# EAGLE schematic MasterPCB_transfer (EAGLE 9.6.2), part 2 of 3
## Sheet 11 of 12: Connectors and fusing
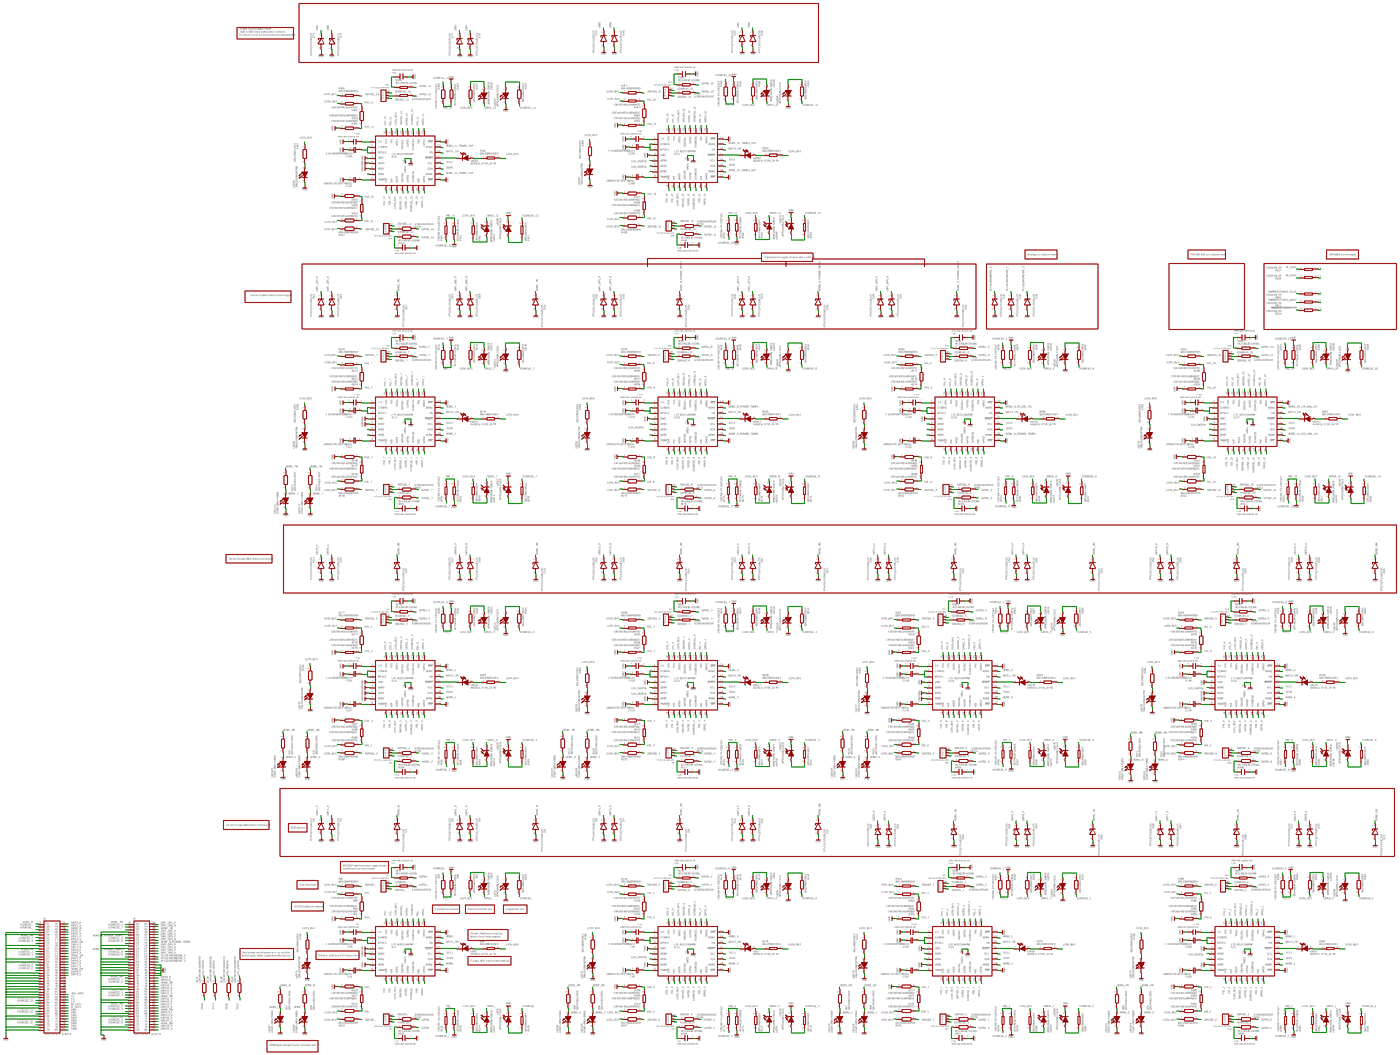
[diagram p13: schematic, sheet 11, overview]
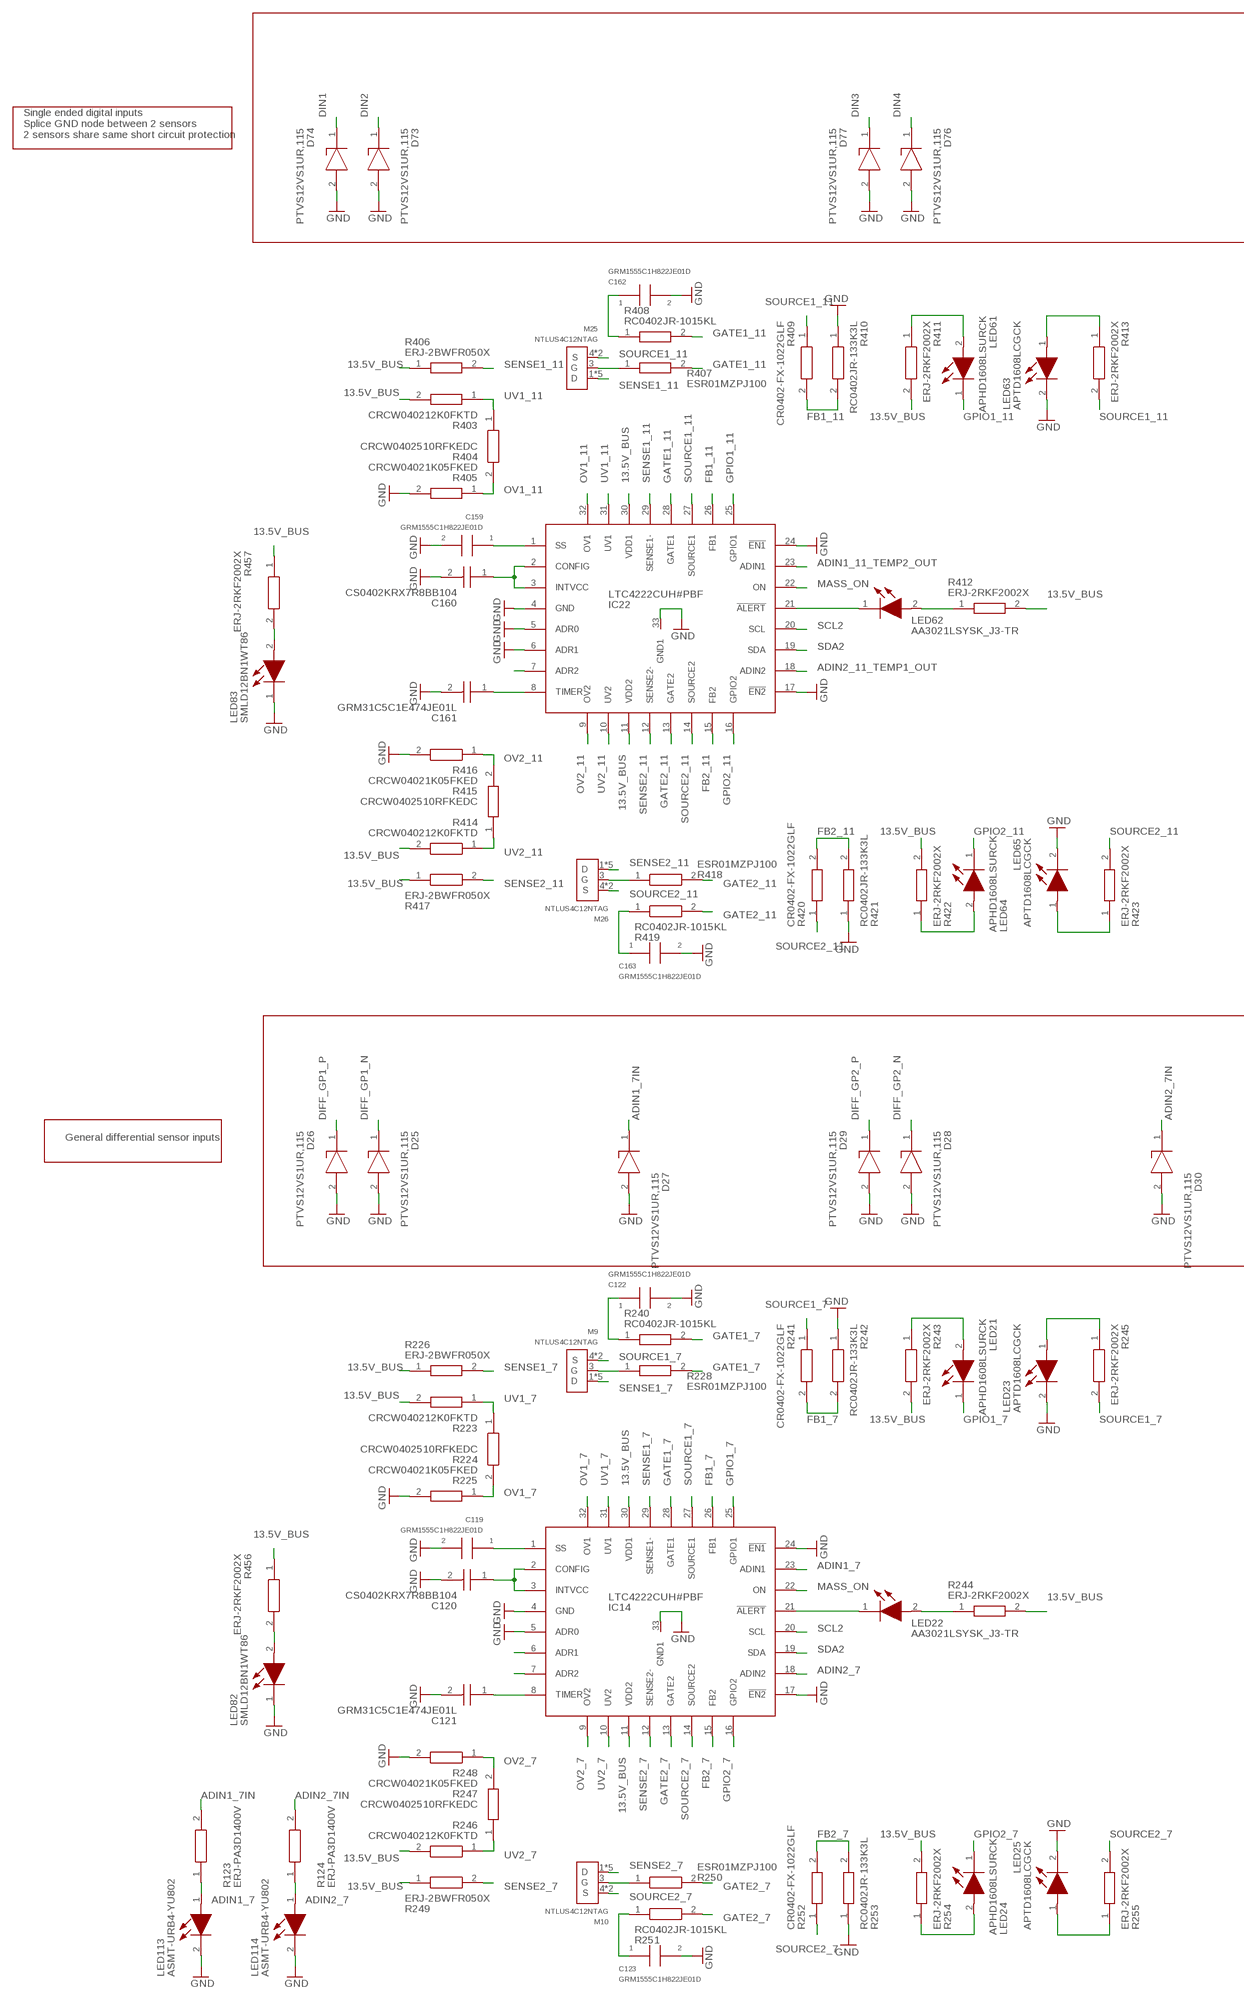
[diagram p14: schematic, sheet 11, part 1 of 6]
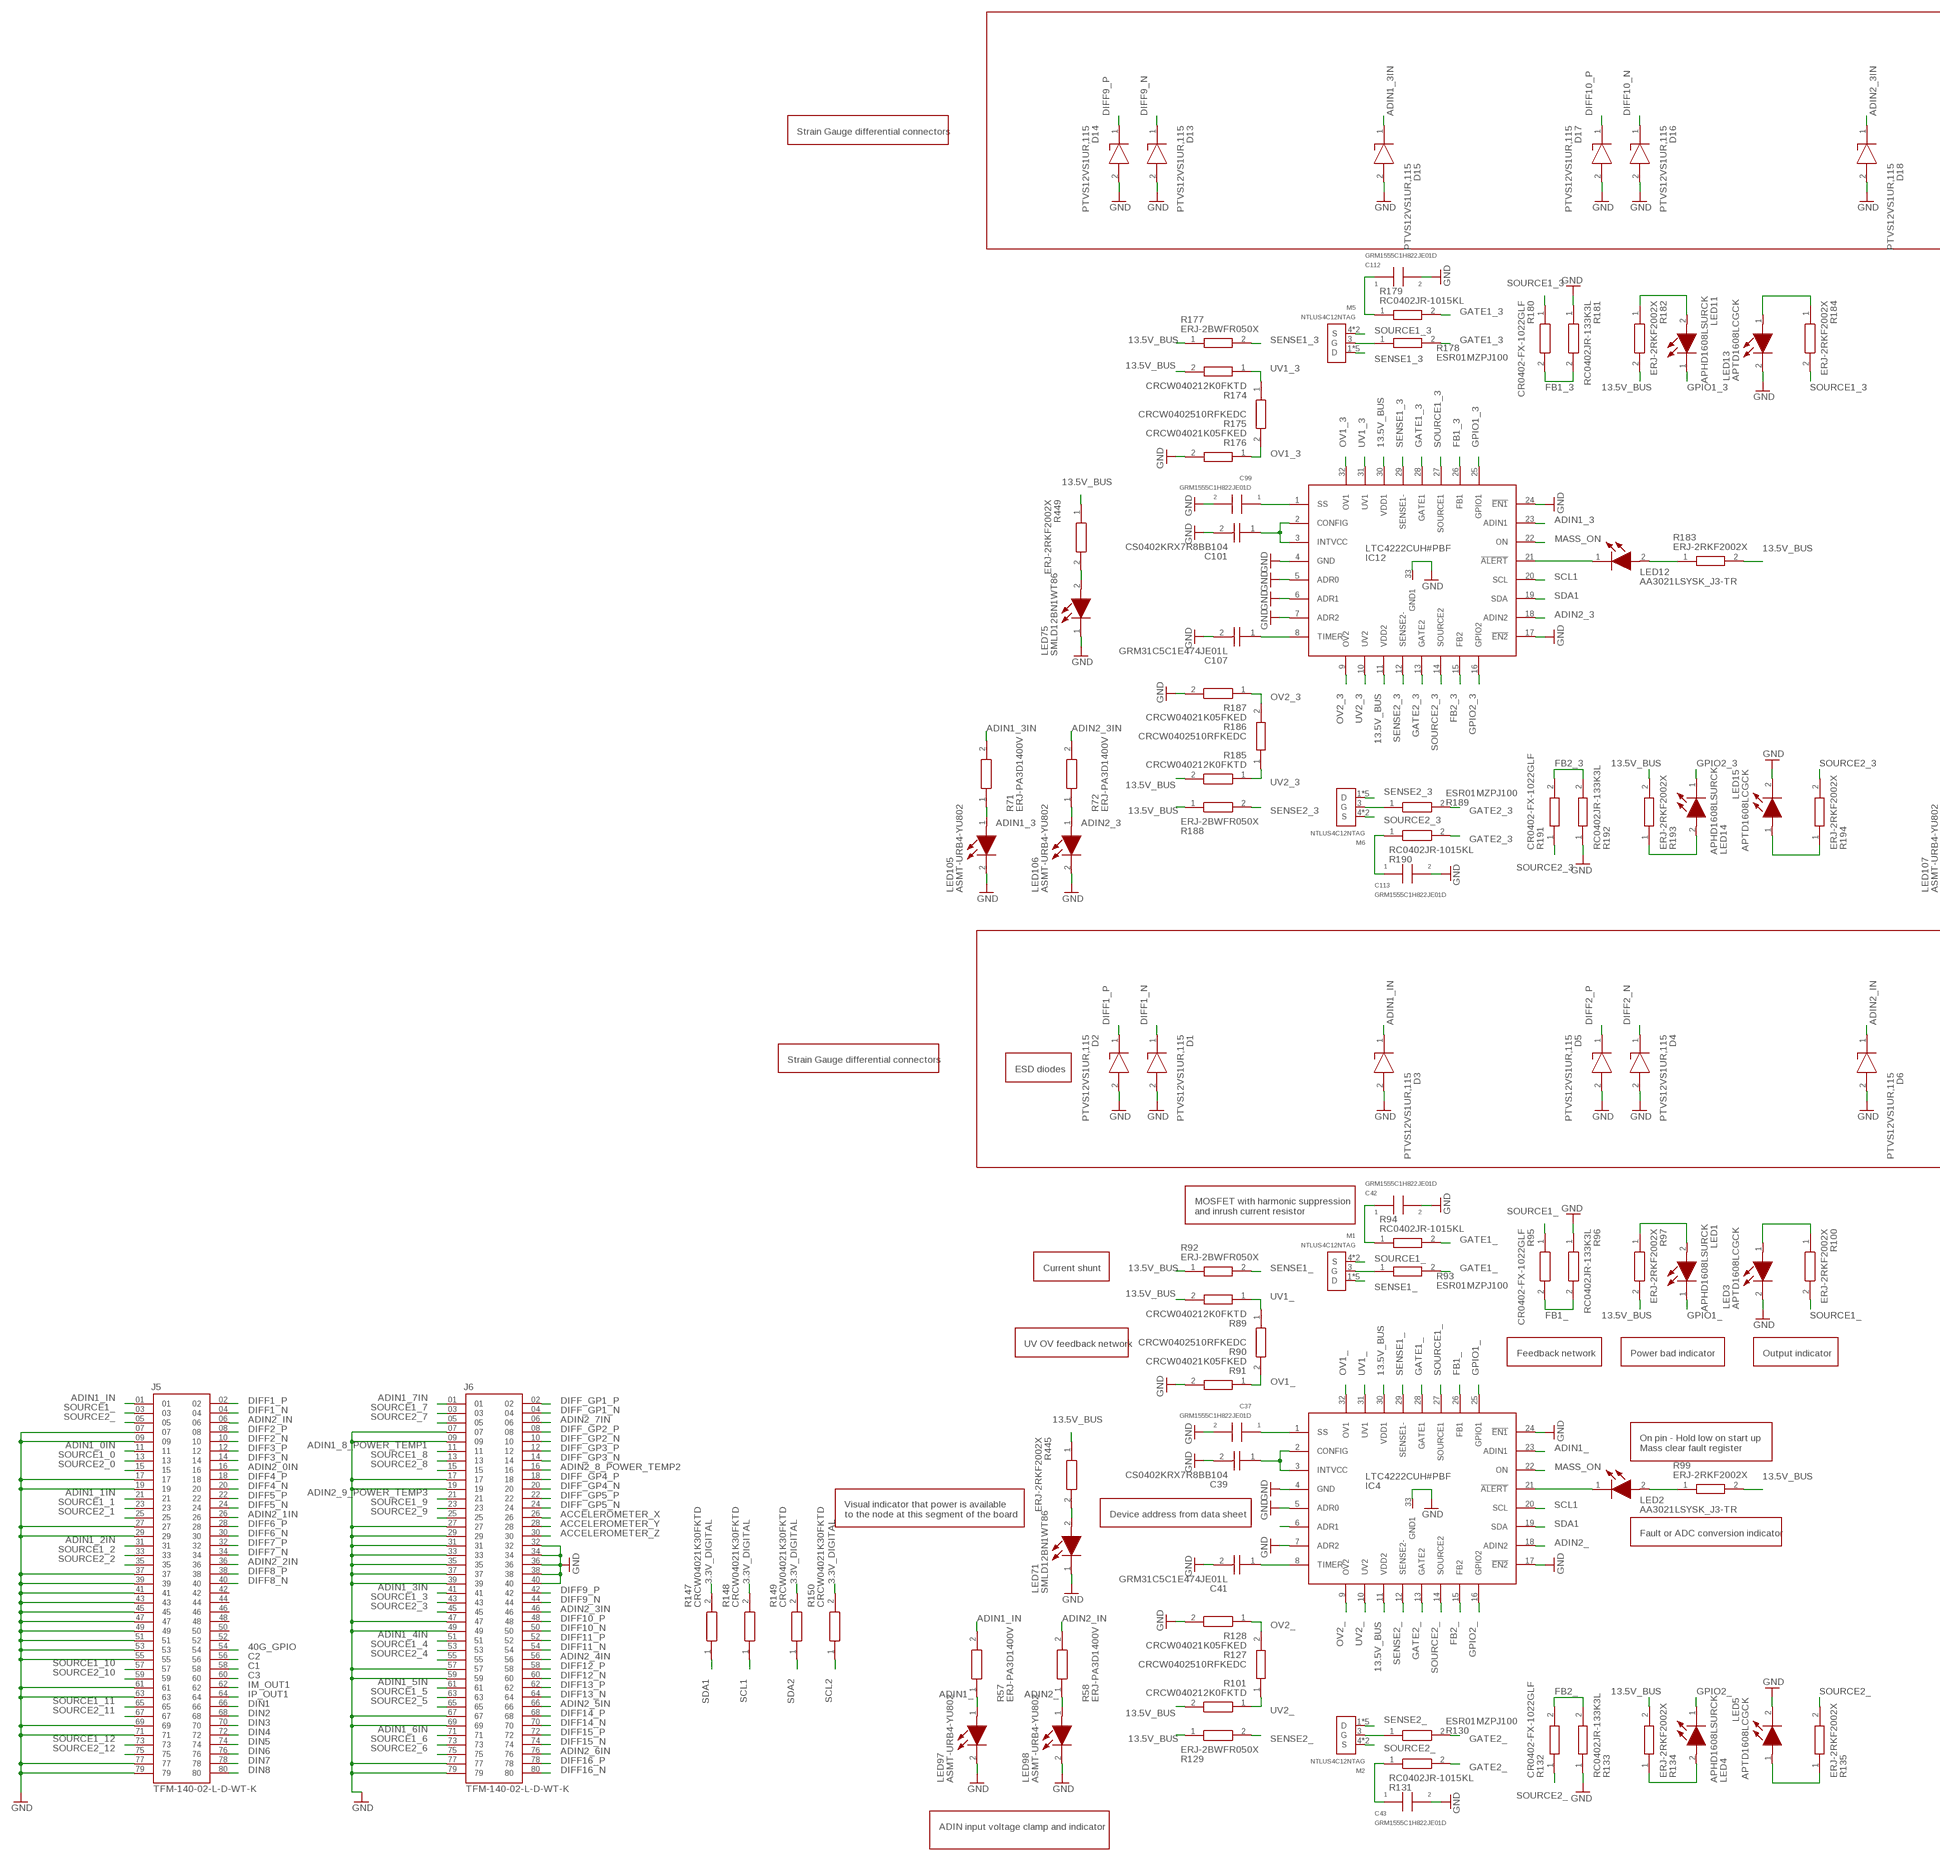
[diagram p15: schematic, sheet 11, part 2 of 6]
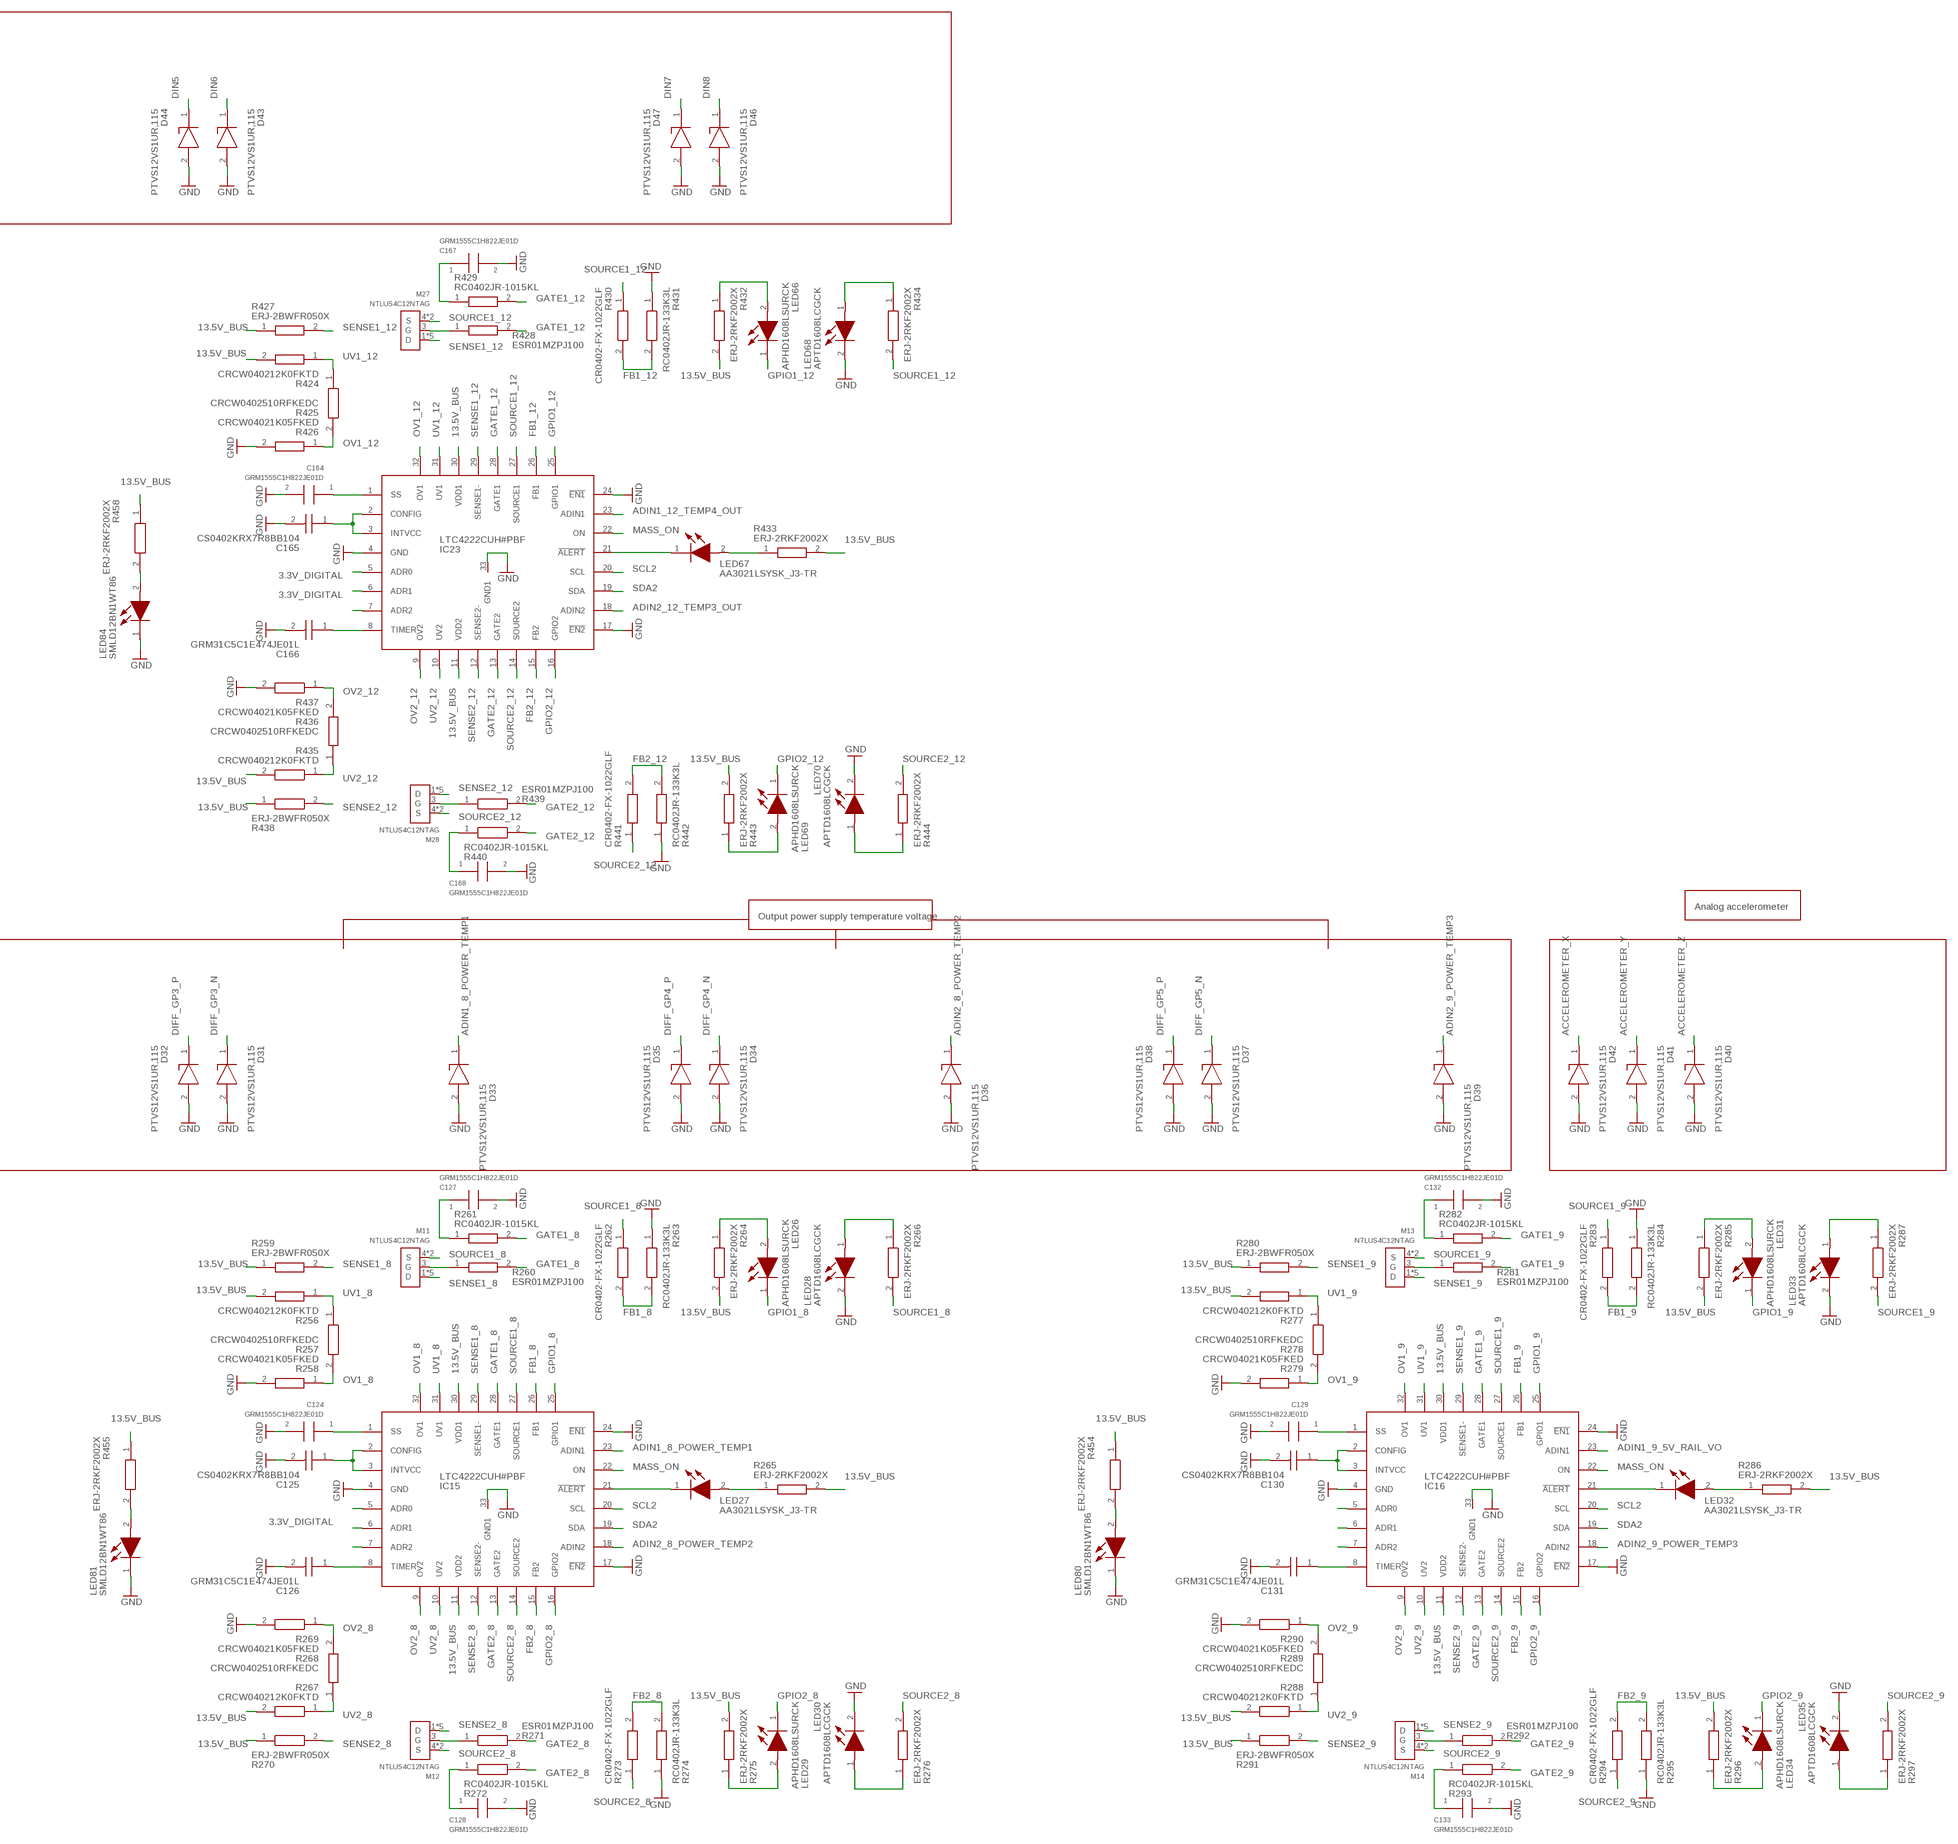
[diagram p16: schematic, sheet 11, part 3 of 6]
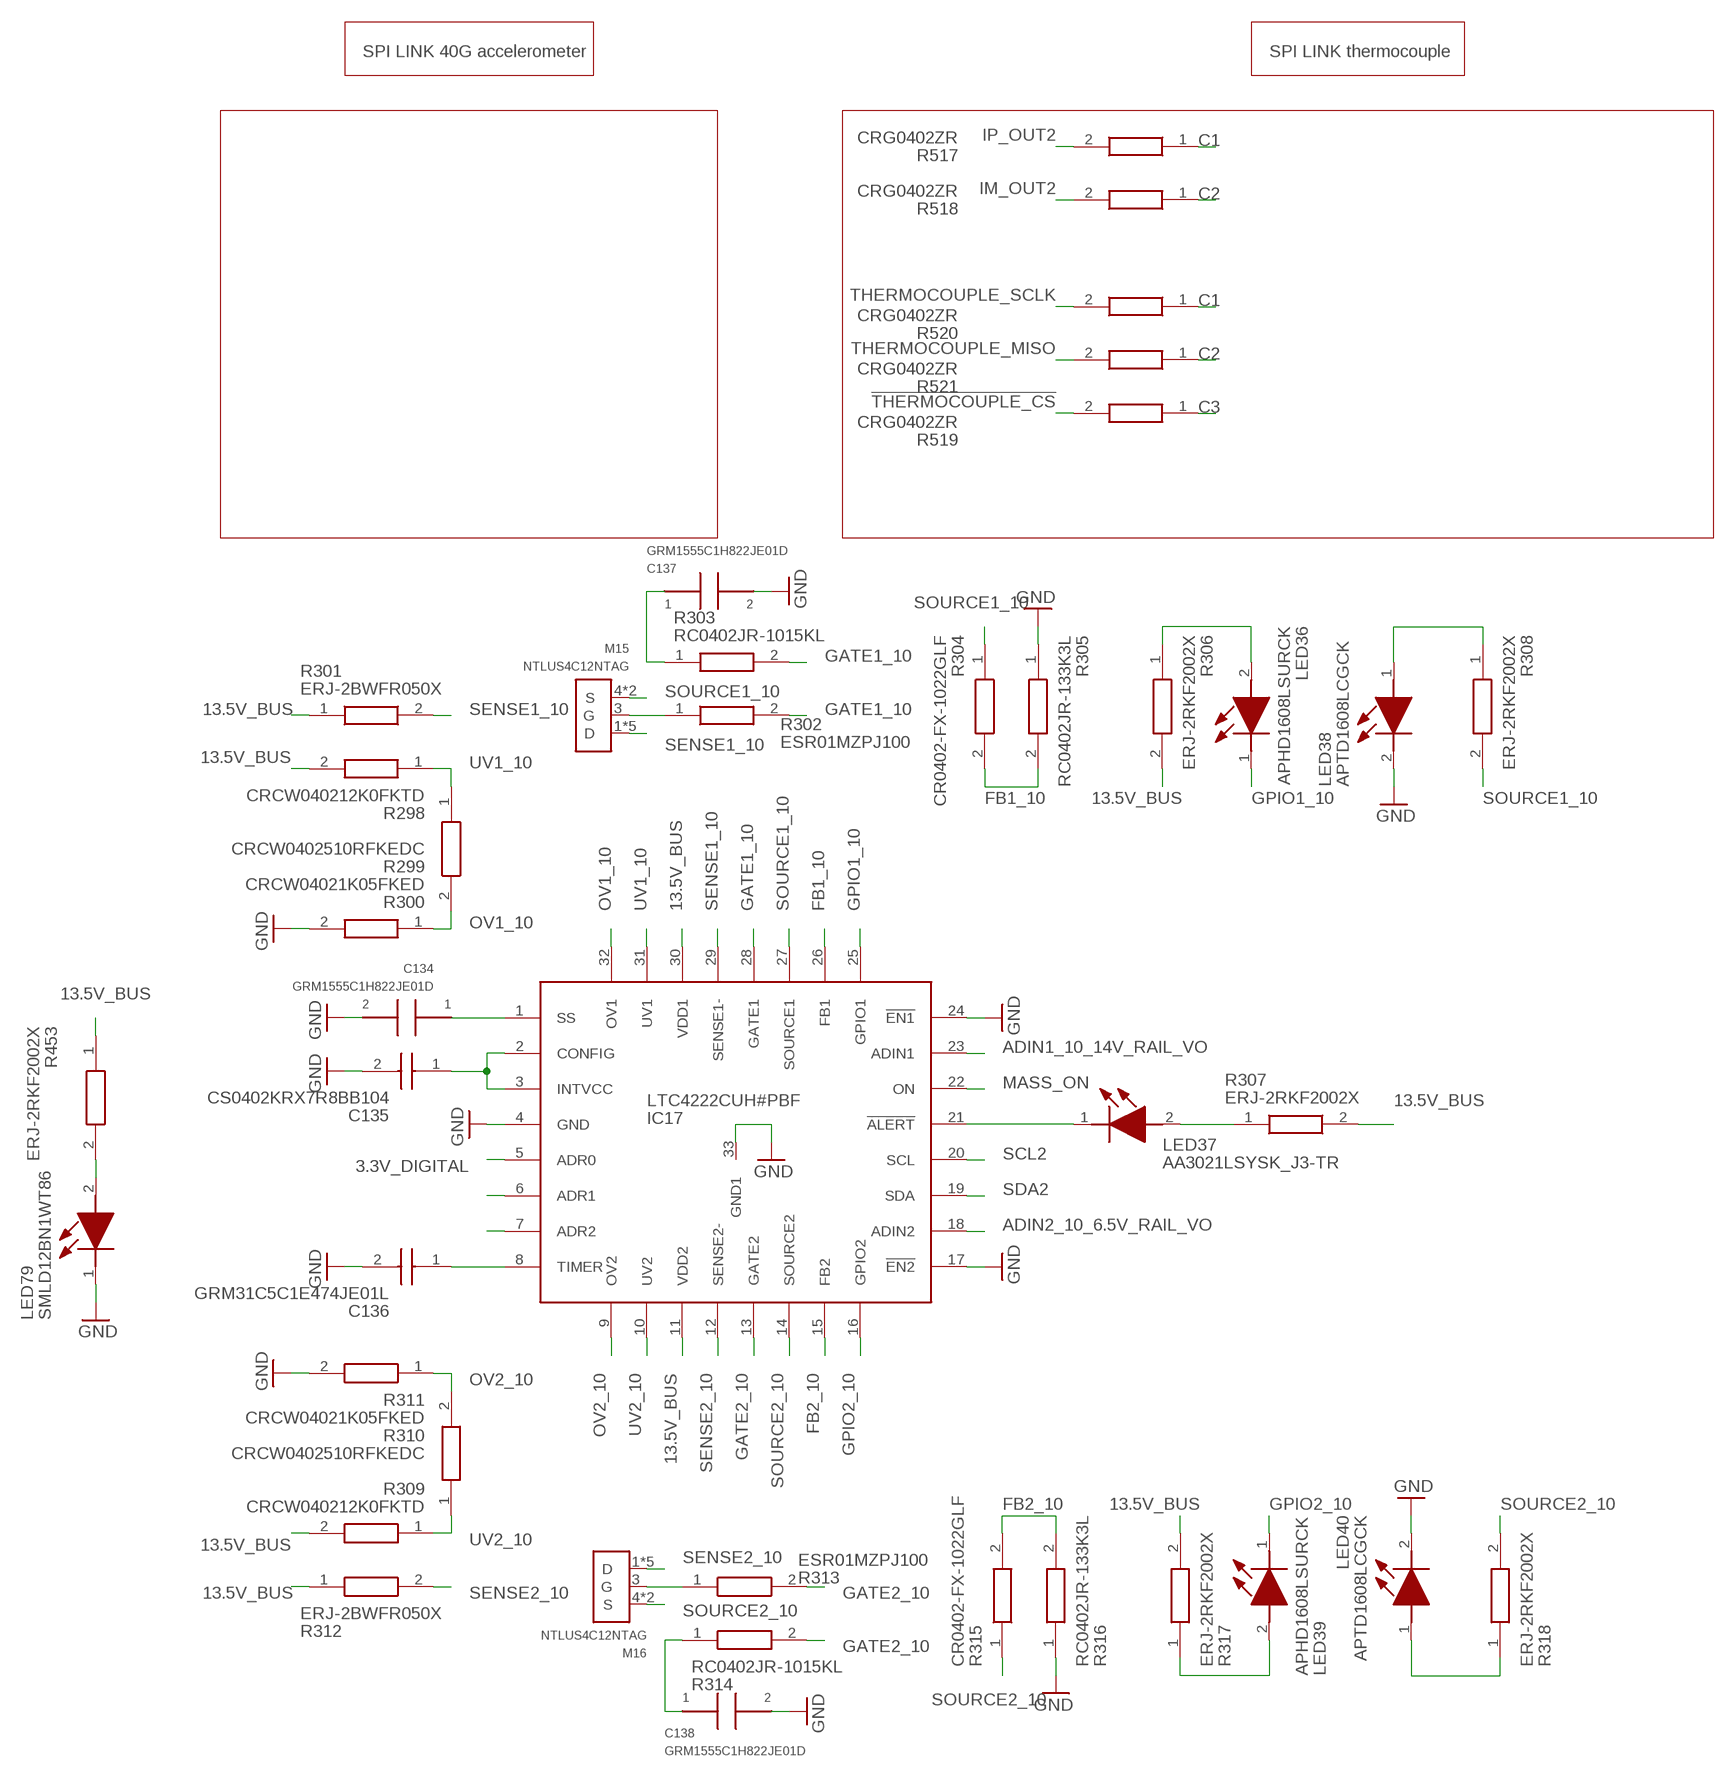
[diagram p17: schematic, sheet 11, part 4 of 6]
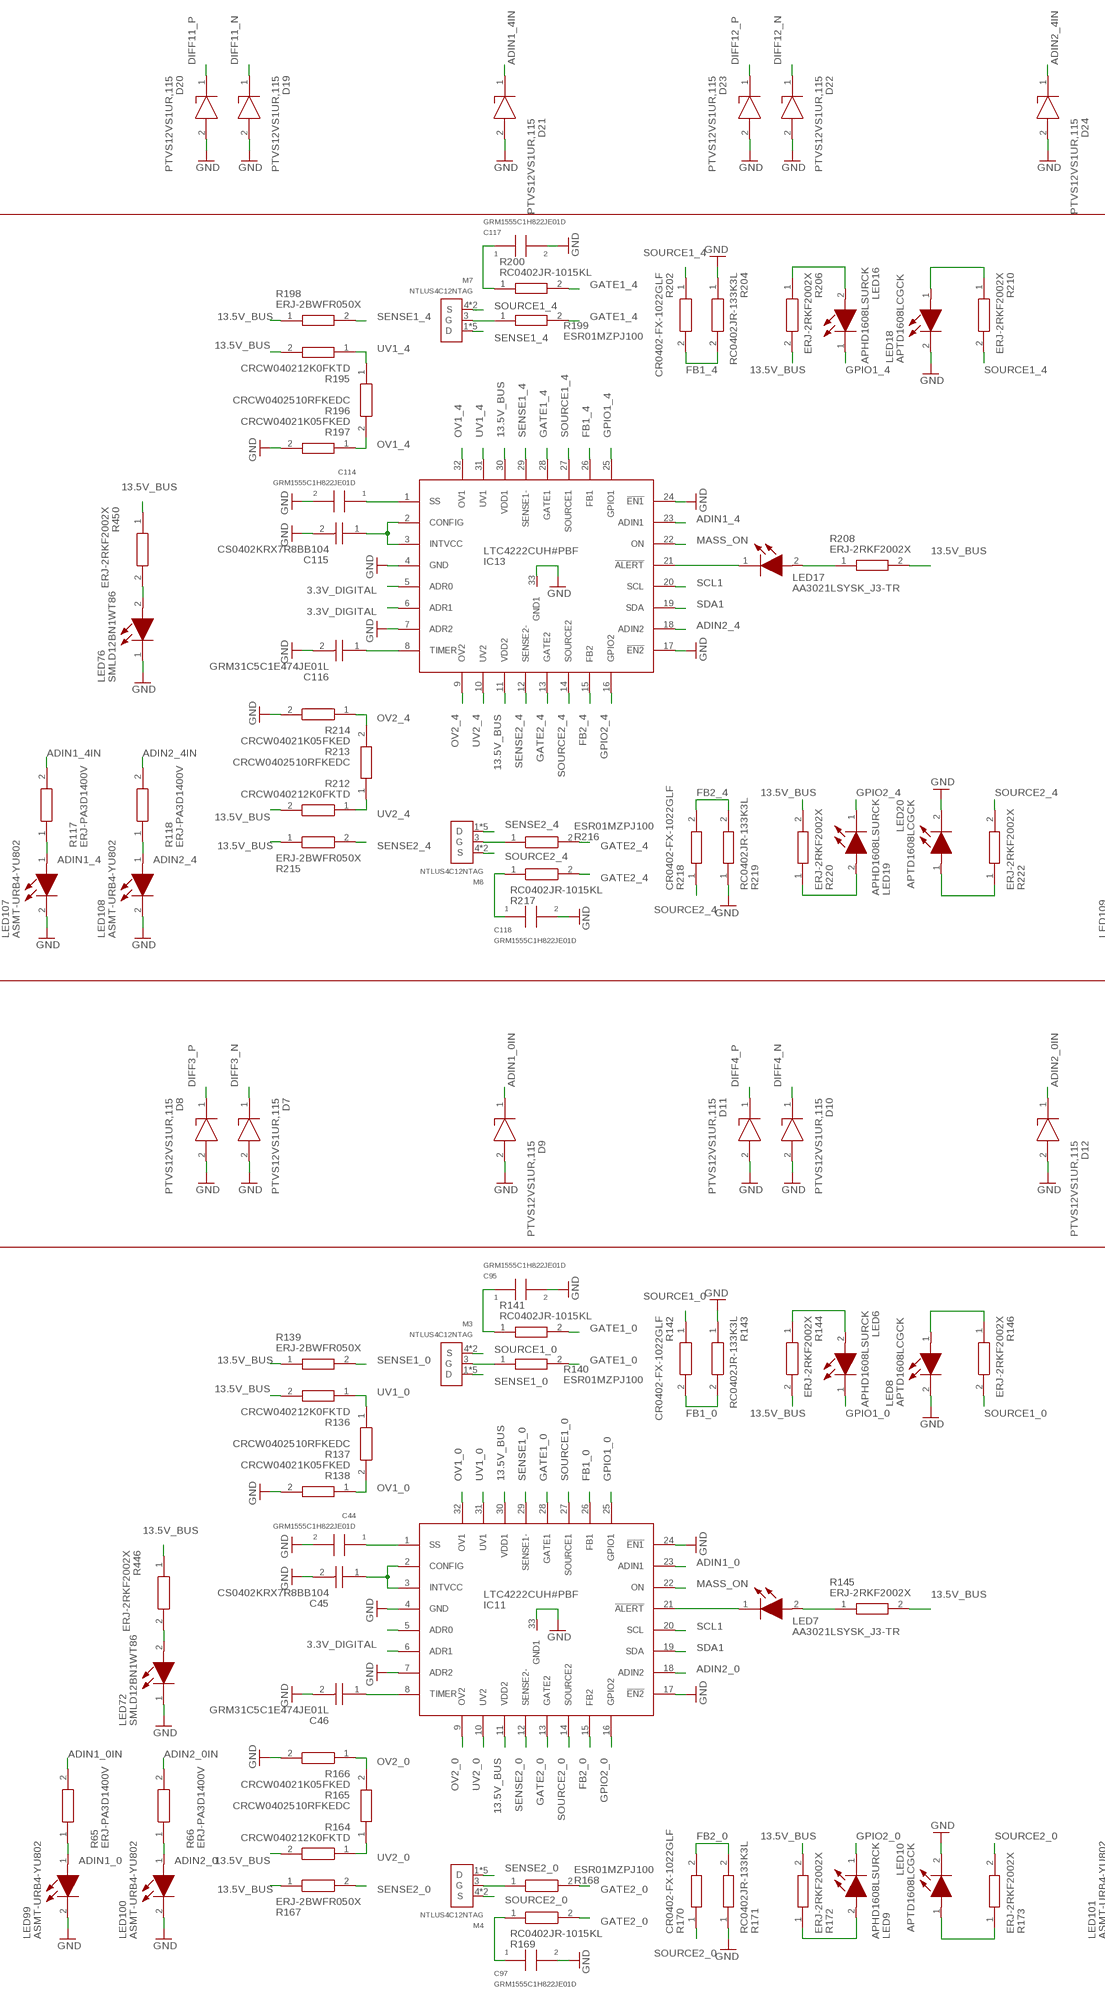
[diagram p18: schematic, sheet 11, part 5 of 6]
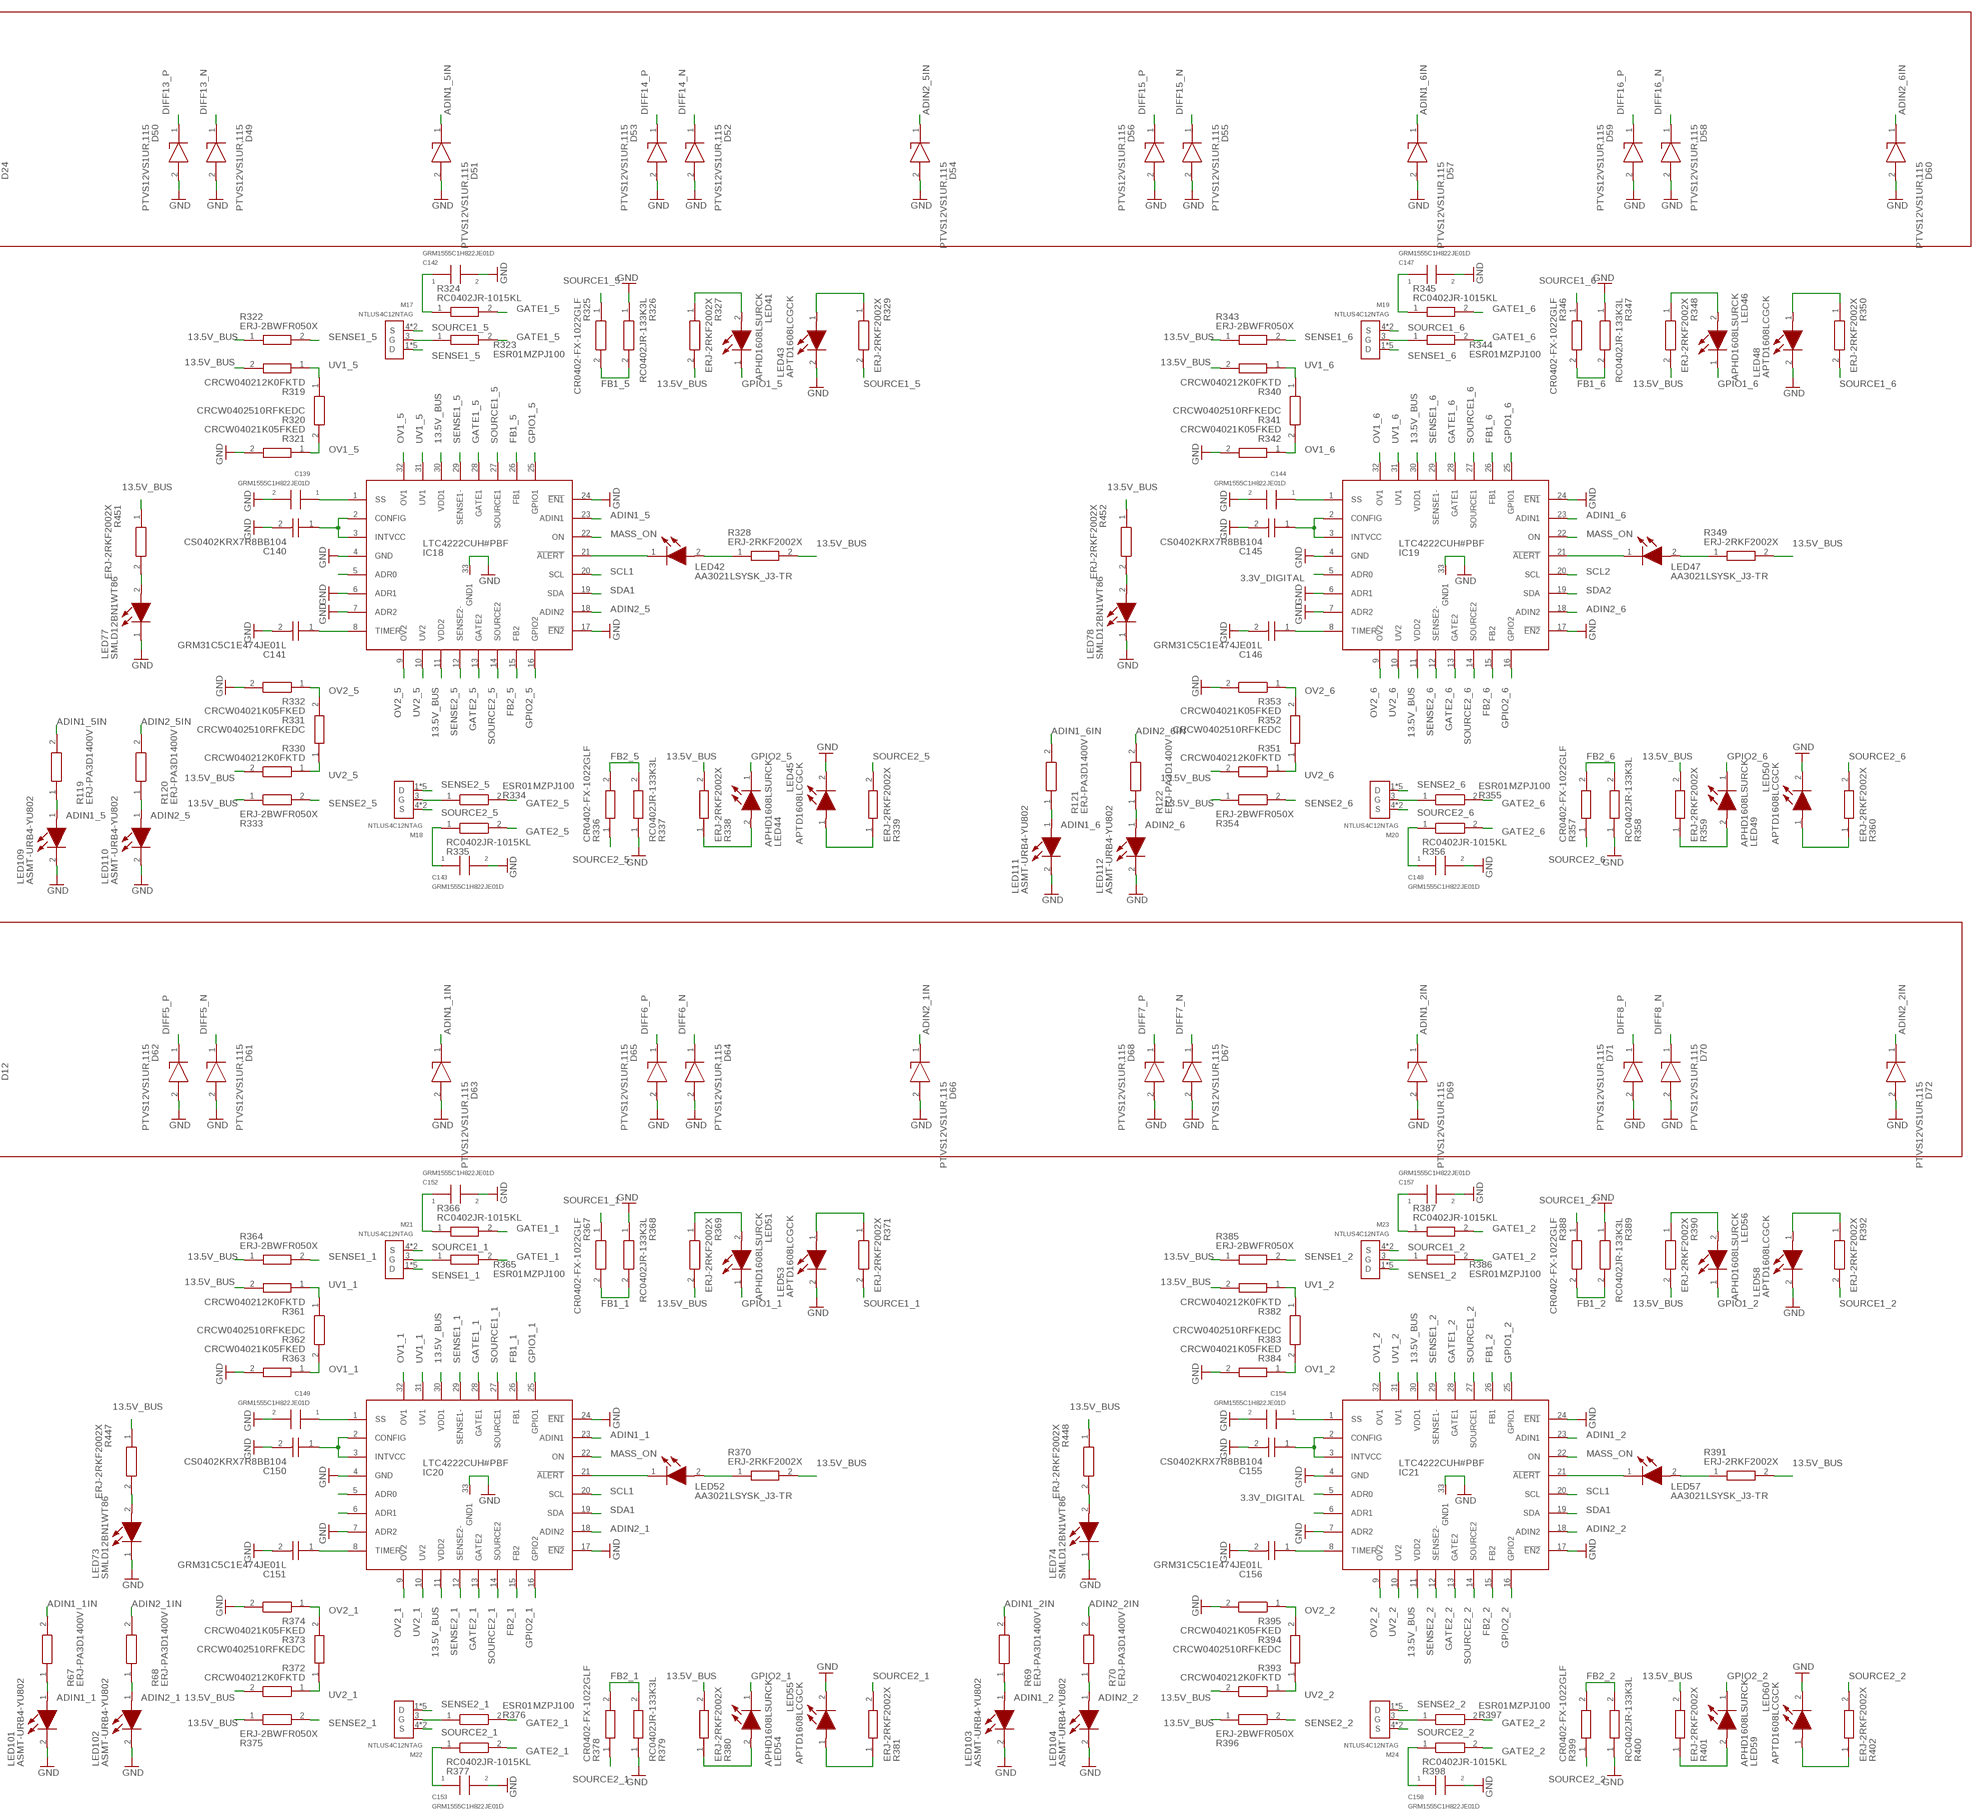
[diagram p19: schematic, sheet 11, part 6 of 6]

### Parts
C37  GRM1555C1H822JE01D  [0402CAP]
C39  CS0402KRX7R8BB104  [CAPC1005X65N]
C41  GRM31C5C1E474JE01L  [CAPC3216X180N]
C42  GRM1555C1H822JE01D  [0402CAP]
C43  GRM1555C1H822JE01D  [0402CAP]
C44  GRM1555C1H822JE01D  [0402CAP]
C45  CS0402KRX7R8BB104  [CAPC1005X65N]
C46  GRM31C5C1E474JE01L  [CAPC3216X180N]
C95  GRM1555C1H822JE01D  [0402CAP]
C97  GRM1555C1H822JE01D  [0402CAP]
C99  GRM1555C1H822JE01D  [0402CAP]
C101  CS0402KRX7R8BB104  [CAPC1005X65N]
C107  GRM31C5C1E474JE01L  [CAPC3216X180N]
C112  GRM1555C1H822JE01D  [0402CAP]
C113  GRM1555C1H822JE01D  [0402CAP]
C114  GRM1555C1H822JE01D  [0402CAP]
C115  CS0402KRX7R8BB104  [CAPC1005X65N]
C116  GRM31C5C1E474JE01L  [CAPC3216X180N]
C117  GRM1555C1H822JE01D  [0402CAP]
C118  GRM1555C1H822JE01D  [0402CAP]
C119  GRM1555C1H822JE01D  [0402CAP]
C120  CS0402KRX7R8BB104  [CAPC1005X65N]
C121  GRM31C5C1E474JE01L  [CAPC3216X180N]
C122  GRM1555C1H822JE01D  [0402CAP]
C123  GRM1555C1H822JE01D  [0402CAP]
C124  GRM1555C1H822JE01D  [0402CAP]
C125  CS0402KRX7R8BB104  [CAPC1005X65N]
C126  GRM31C5C1E474JE01L  [CAPC3216X180N]
C127  GRM1555C1H822JE01D  [0402CAP]
C128  GRM1555C1H822JE01D  [0402CAP]
C129  GRM1555C1H822JE01D  [0402CAP]
C130  CS0402KRX7R8BB104  [CAPC1005X65N]
C131  GRM31C5C1E474JE01L  [CAPC3216X180N]
C132  GRM1555C1H822JE01D  [0402CAP]
C133  GRM1555C1H822JE01D  [0402CAP]
C134  GRM1555C1H822JE01D  [0402CAP]
C135  CS0402KRX7R8BB104  [CAPC1005X65N]
C136  GRM31C5C1E474JE01L  [CAPC3216X180N]
C137  GRM1555C1H822JE01D  [0402CAP]
C138  GRM1555C1H822JE01D  [0402CAP]
C139  GRM1555C1H822JE01D  [0402CAP]
C140  CS0402KRX7R8BB104  [CAPC1005X65N]
C141  GRM31C5C1E474JE01L  [CAPC3216X180N]
C142  GRM1555C1H822JE01D  [0402CAP]
C143  GRM1555C1H822JE01D  [0402CAP]
C144  GRM1555C1H822JE01D  [0402CAP]
C145  CS0402KRX7R8BB104  [CAPC1005X65N]
C146  GRM31C5C1E474JE01L  [CAPC3216X180N]
C147  GRM1555C1H822JE01D  [0402CAP]
C148  GRM1555C1H822JE01D  [0402CAP]
C149  GRM1555C1H822JE01D  [0402CAP]
C150  CS0402KRX7R8BB104  [CAPC1005X65N]
C151  GRM31C5C1E474JE01L  [CAPC3216X180N]
C152  GRM1555C1H822JE01D  [0402CAP]
C153  GRM1555C1H822JE01D  [0402CAP]
C154  GRM1555C1H822JE01D  [0402CAP]
C155  CS0402KRX7R8BB104  [CAPC1005X65N]
C156  GRM31C5C1E474JE01L  [CAPC3216X180N]
C157  GRM1555C1H822JE01D  [0402CAP]
C158  GRM1555C1H822JE01D  [0402CAP]
C159  GRM1555C1H822JE01D  [0402CAP]
C160  CS0402KRX7R8BB104  [CAPC1005X65N]
C161  GRM31C5C1E474JE01L  [CAPC3216X180N]
C162  GRM1555C1H822JE01D  [0402CAP]
C163  GRM1555C1H822JE01D  [0402CAP]
C164  GRM1555C1H822JE01D  [0402CAP]
C165  CS0402KRX7R8BB104  [CAPC1005X65N]
C166  GRM31C5C1E474JE01L  [CAPC3216X180N]
C167  GRM1555C1H822JE01D  [0402CAP]
C168  GRM1555C1H822JE01D  [0402CAP]
D1  PTVS12VS1UR,115  [SOD123W]
D2  PTVS12VS1UR,115  [SOD123W]
D3  PTVS12VS1UR,115  [SOD123W]
D4  PTVS12VS1UR,115  [SOD123W]
D5  PTVS12VS1UR,115  [SOD123W]
D6  PTVS12VS1UR,115  [SOD123W]
D7  PTVS12VS1UR,115  [SOD123W]
D8  PTVS12VS1UR,115  [SOD123W]
D9  PTVS12VS1UR,115  [SOD123W]
D10  PTVS12VS1UR,115  [SOD123W]
D11  PTVS12VS1UR,115  [SOD123W]
D12  PTVS12VS1UR,115  [SOD123W]
D13  PTVS12VS1UR,115  [SOD123W]
D14  PTVS12VS1UR,115  [SOD123W]
D15  PTVS12VS1UR,115  [SOD123W]
D16  PTVS12VS1UR,115  [SOD123W]
D17  PTVS12VS1UR,115  [SOD123W]
D18  PTVS12VS1UR,115  [SOD123W]
D19  PTVS12VS1UR,115  [SOD123W]
D20  PTVS12VS1UR,115  [SOD123W]
D21  PTVS12VS1UR,115  [SOD123W]
D22  PTVS12VS1UR,115  [SOD123W]
D23  PTVS12VS1UR,115  [SOD123W]
D24  PTVS12VS1UR,115  [SOD123W]
D25  PTVS12VS1UR,115  [SOD123W]
D26  PTVS12VS1UR,115  [SOD123W]
D27  PTVS12VS1UR,115  [SOD123W]
D28  PTVS12VS1UR,115  [SOD123W]
D29  PTVS12VS1UR,115  [SOD123W]
D30  PTVS12VS1UR,115  [SOD123W]
D31  PTVS12VS1UR,115  [SOD123W]
D32  PTVS12VS1UR,115  [SOD123W]
D33  PTVS12VS1UR,115  [SOD123W]
D34  PTVS12VS1UR,115  [SOD123W]
D35  PTVS12VS1UR,115  [SOD123W]
D36  PTVS12VS1UR,115  [SOD123W]
D37  PTVS12VS1UR,115  [SOD123W]
D38  PTVS12VS1UR,115  [SOD123W]
D39  PTVS12VS1UR,115  [SOD123W]
D40  PTVS12VS1UR,115  [SOD123W]
D41  PTVS12VS1UR,115  [SOD123W]
D42  PTVS12VS1UR,115  [SOD123W]
D43  PTVS12VS1UR,115  [SOD123W]
D44  PTVS12VS1UR,115  [SOD123W]
D46  PTVS12VS1UR,115  [SOD123W]
D47  PTVS12VS1UR,115  [SOD123W]
D49  PTVS12VS1UR,115  [SOD123W]
D50  PTVS12VS1UR,115  [SOD123W]
D51  PTVS12VS1UR,115  [SOD123W]
D52  PTVS12VS1UR,115  [SOD123W]
D53  PTVS12VS1UR,115  [SOD123W]
D54  PTVS12VS1UR,115  [SOD123W]
D55  PTVS12VS1UR,115  [SOD123W]
D56  PTVS12VS1UR,115  [SOD123W]
D57  PTVS12VS1UR,115  [SOD123W]
D58  PTVS12VS1UR,115  [SOD123W]
D59  PTVS12VS1UR,115  [SOD123W]
D60  PTVS12VS1UR,115  [SOD123W]
D61  PTVS12VS1UR,115  [SOD123W]
D62  PTVS12VS1UR,115  [SOD123W]
D63  PTVS12VS1UR,115  [SOD123W]
D64  PTVS12VS1UR,115  [SOD123W]
D65  PTVS12VS1UR,115  [SOD123W]
D66  PTVS12VS1UR,115  [SOD123W]
D67  PTVS12VS1UR,115  [SOD123W]
D68  PTVS12VS1UR,115  [SOD123W]
D69  PTVS12VS1UR,115  [SOD123W]
D70  PTVS12VS1UR,115  [SOD123W]
D71  PTVS12VS1UR,115  [SOD123W]
D72  PTVS12VS1UR,115  [SOD123W]
D73  PTVS12VS1UR,115  [SOD123W]
D74  PTVS12VS1UR,115  [SOD123W]
D76  PTVS12VS1UR,115  [SOD123W]
D77  PTVS12VS1UR,115  [SOD123W]
IC4  LTC4222CUH#PBF  [QFN50P500X500X80-33T345N]
IC11  LTC4222CUH#PBF  [QFN50P500X500X80-33T345N]
IC12  LTC4222CUH#PBF  [QFN50P500X500X80-33T345N]
IC13  LTC4222CUH#PBF  [QFN50P500X500X80-33T345N]
IC14  LTC4222CUH#PBF  [QFN50P500X500X80-33T345N]
IC15  LTC4222CUH#PBF  [QFN50P500X500X80-33T345N]
IC16  LTC4222CUH#PBF  [QFN50P500X500X80-33T345N]
IC17  LTC4222CUH#PBF  [QFN50P500X500X80-33T345N]
IC18  LTC4222CUH#PBF  [QFN50P500X500X80-33T345N]
IC19  LTC4222CUH#PBF  [QFN50P500X500X80-33T345N]
IC20  LTC4222CUH#PBF  [QFN50P500X500X80-33T345N]
IC21  LTC4222CUH#PBF  [QFN50P500X500X80-33T345N]
IC22  LTC4222CUH#PBF  [QFN50P500X500X80-33T345N]
IC23  LTC4222CUH#PBF  [QFN50P500X500X80-33T345N]
J5  TFM-140-02-L-D-WT-K  [SAMTEC_TFM-140-02-L-D-WT-K]
J6  TFM-140-02-L-D-WT-K  [SAMTEC_TFM-140-02-L-D-WT-K]
LED1  APHD1608LSURCK  [LEDM168X80N]
LED2  AA3021LSYSK_J3-TR  [AA3021LSYSKJ3TR]
LED3  APTD1608LCGCK  [APT1608CGCK]
LED4  APHD1608LSURCK  [LEDM168X80N]
LED5  APTD1608LCGCK  [APT1608CGCK]
LED6  APHD1608LSURCK  [LEDM168X80N]
LED7  AA3021LSYSK_J3-TR  [AA3021LSYSKJ3TR]
LED8  APTD1608LCGCK  [APT1608CGCK]
LED9  APHD1608LSURCK  [LEDM168X80N]
LED10  APTD1608LCGCK  [APT1608CGCK]
LED11  APHD1608LSURCK  [LEDM168X80N]
LED12  AA3021LSYSK_J3-TR  [AA3021LSYSKJ3TR]
LED13  APTD1608LCGCK  [APT1608CGCK]
LED14  APHD1608LSURCK  [LEDM168X80N]
LED15  APTD1608LCGCK  [APT1608CGCK]
LED16  APHD1608LSURCK  [LEDM168X80N]
LED17  AA3021LSYSK_J3-TR  [AA3021LSYSKJ3TR]
LED18  APTD1608LCGCK  [APT1608CGCK]
LED19  APHD1608LSURCK  [LEDM168X80N]
LED20  APTD1608LCGCK  [APT1608CGCK]
LED21  APHD1608LSURCK  [LEDM168X80N]
LED22  AA3021LSYSK_J3-TR  [AA3021LSYSKJ3TR]
LED23  APTD1608LCGCK  [APT1608CGCK]
LED24  APHD1608LSURCK  [LEDM168X80N]
LED25  APTD1608LCGCK  [APT1608CGCK]
LED26  APHD1608LSURCK  [LEDM168X80N]
LED27  AA3021LSYSK_J3-TR  [AA3021LSYSKJ3TR]
LED28  APTD1608LCGCK  [APT1608CGCK]
LED29  APHD1608LSURCK  [LEDM168X80N]
LED30  APTD1608LCGCK  [APT1608CGCK]
LED31  APHD1608LSURCK  [LEDM168X80N]
LED32  AA3021LSYSK_J3-TR  [AA3021LSYSKJ3TR]
LED33  APTD1608LCGCK  [APT1608CGCK]
LED34  APHD1608LSURCK  [LEDM168X80N]
LED35  APTD1608LCGCK  [APT1608CGCK]
LED36  APHD1608LSURCK  [LEDM168X80N]
LED37  AA3021LSYSK_J3-TR  [AA3021LSYSKJ3TR]
LED38  APTD1608LCGCK  [APT1608CGCK]
LED39  APHD1608LSURCK  [LEDM168X80N]
LED40  APTD1608LCGCK  [APT1608CGCK]
LED41  APHD1608LSURCK  [LEDM168X80N]
LED42  AA3021LSYSK_J3-TR  [AA3021LSYSKJ3TR]
LED43  APTD1608LCGCK  [APT1608CGCK]
LED44  APHD1608LSURCK  [LEDM168X80N]
LED45  APTD1608LCGCK  [APT1608CGCK]
LED46  APHD1608LSURCK  [LEDM168X80N]
LED47  AA3021LSYSK_J3-TR  [AA3021LSYSKJ3TR]
LED48  APTD1608LCGCK  [APT1608CGCK]
LED49  APHD1608LSURCK  [LEDM168X80N]
LED50  APTD1608LCGCK  [APT1608CGCK]
LED51  APHD1608LSURCK  [LEDM168X80N]
LED52  AA3021LSYSK_J3-TR  [AA3021LSYSKJ3TR]
LED53  APTD1608LCGCK  [APT1608CGCK]
LED54  APHD1608LSURCK  [LEDM168X80N]
LED55  APTD1608LCGCK  [APT1608CGCK]
LED56  APHD1608LSURCK  [LEDM168X80N]
LED57  AA3021LSYSK_J3-TR  [AA3021LSYSKJ3TR]
LED58  APTD1608LCGCK  [APT1608CGCK]
LED59  APHD1608LSURCK  [LEDM168X80N]
LED60  APTD1608LCGCK  [APT1608CGCK]
LED61  APHD1608LSURCK  [LEDM168X80N]
LED62  AA3021LSYSK_J3-TR  [AA3021LSYSKJ3TR]
LED63  APTD1608LCGCK  [APT1608CGCK]
LED64  APHD1608LSURCK  [LEDM168X80N]
LED65  APTD1608LCGCK  [APT1608CGCK]
LED66  APHD1608LSURCK  [LEDM168X80N]
LED67  AA3021LSYSK_J3-TR  [AA3021LSYSKJ3TR]
LED68  APTD1608LCGCK  [APT1608CGCK]
LED69  APHD1608LSURCK  [LEDM168X80N]
LED70  APTD1608LCGCK  [APT1608CGCK]
LED71  SMLD12BN1WT86  [LEDM168X65N]
LED72  SMLD12BN1WT86  [LEDM168X65N]
LED73  SMLD12BN1WT86  [LEDM168X65N]
LED74  SMLD12BN1WT86  [LEDM168X65N]
LED75  SMLD12BN1WT86  [LEDM168X65N]
LED76  SMLD12BN1WT86  [LEDM168X65N]
LED77  SMLD12BN1WT86  [LEDM168X65N]
LED78  SMLD12BN1WT86  [LEDM168X65N]
LED79  SMLD12BN1WT86  [LEDM168X65N]
LED80  SMLD12BN1WT86  [LEDM168X65N]
LED81  SMLD12BN1WT86  [LEDM168X65N]
LED82  SMLD12BN1WT86  [LEDM168X65N]
LED83  SMLD12BN1WT86  [LEDM168X65N]
LED84  SMLD12BN1WT86  [LEDM168X65N]
LED97  ASMT-URB4-YU802  [ASMTURB4YU802]
LED98  ASMT-URB4-YU802  [ASMTURB4YU802]
LED99  ASMT-URB4-YU802  [ASMTURB4YU802]
LED100  ASMT-URB4-YU802  [ASMTURB4YU802]
LED101  ASMT-URB4-YU802  [ASMTURB4YU802]
LED102  ASMT-URB4-YU802  [ASMTURB4YU802]
LED103  ASMT-URB4-YU802  [ASMTURB4YU802]
LED104  ASMT-URB4-YU802  [ASMTURB4YU802]
LED105  ASMT-URB4-YU802  [ASMTURB4YU802]
LED106  ASMT-URB4-YU802  [ASMTURB4YU802]
LED107  ASMT-URB4-YU802  [ASMTURB4YU802]
LED108  ASMT-URB4-YU802  [ASMTURB4YU802]
LED109  ASMT-URB4-YU802  [ASMTURB4YU802]
LED110  ASMT-URB4-YU802  [ASMTURB4YU802]
LED111  ASMT-URB4-YU802  [ASMTURB4YU802]
LED112  ASMT-URB4-YU802  [ASMTURB4YU802]
LED113  ASMT-URB4-YU802  [ASMTURB4YU802]
LED114  ASMT-URB4-YU802  [ASMTURB4YU802]
M1  NTLUS4C12NTAG  [TRANS_NTLUS3A18PZTAG]
M2  NTLUS4C12NTAG  [TRANS_NTLUS3A18PZTAG]
M3  NTLUS4C12NTAG  [TRANS_NTLUS3A18PZTAG]
M4  NTLUS4C12NTAG  [TRANS_NTLUS3A18PZTAG]
M5  NTLUS4C12NTAG  [TRANS_NTLUS3A18PZTAG]
M6  NTLUS4C12NTAG  [TRANS_NTLUS3A18PZTAG]
M7  NTLUS4C12NTAG  [TRANS_NTLUS3A18PZTAG]
M8  NTLUS4C12NTAG  [TRANS_NTLUS3A18PZTAG]
M9  NTLUS4C12NTAG  [TRANS_NTLUS3A18PZTAG]
M10  NTLUS4C12NTAG  [TRANS_NTLUS3A18PZTAG]
M11  NTLUS4C12NTAG  [TRANS_NTLUS3A18PZTAG]
M12  NTLUS4C12NTAG  [TRANS_NTLUS3A18PZTAG]
M13  NTLUS4C12NTAG  [TRANS_NTLUS3A18PZTAG]
M14  NTLUS4C12NTAG  [TRANS_NTLUS3A18PZTAG]
M15  NTLUS4C12NTAG  [TRANS_NTLUS3A18PZTAG]
M16  NTLUS4C12NTAG  [TRANS_NTLUS3A18PZTAG]
M17  NTLUS4C12NTAG  [TRANS_NTLUS3A18PZTAG]
M18  NTLUS4C12NTAG  [TRANS_NTLUS3A18PZTAG]
M19  NTLUS4C12NTAG  [TRANS_NTLUS3A18PZTAG]
M20  NTLUS4C12NTAG  [TRANS_NTLUS3A18PZTAG]
M21  NTLUS4C12NTAG  [TRANS_NTLUS3A18PZTAG]
M22  NTLUS4C12NTAG  [TRANS_NTLUS3A18PZTAG]
M23  NTLUS4C12NTAG  [TRANS_NTLUS3A18PZTAG]
M24  NTLUS4C12NTAG  [TRANS_NTLUS3A18PZTAG]
M25  NTLUS4C12NTAG  [TRANS_NTLUS3A18PZTAG]
M26  NTLUS4C12NTAG  [TRANS_NTLUS3A18PZTAG]
M27  NTLUS4C12NTAG  [TRANS_NTLUS3A18PZTAG]
M28  NTLUS4C12NTAG  [TRANS_NTLUS3A18PZTAG]
R57  ERJ-PA3D1400V  [ERJP03_PA3_(0603)]
R58  ERJ-PA3D1400V  [ERJP03_PA3_(0603)]
R65  ERJ-PA3D1400V  [ERJP03_PA3_(0603)]
R66  ERJ-PA3D1400V  [ERJP03_PA3_(0603)]
R67  ERJ-PA3D1400V  [ERJP03_PA3_(0603)]
R68  ERJ-PA3D1400V  [ERJP03_PA3_(0603)]
R69  ERJ-PA3D1400V  [ERJP03_PA3_(0603)]
R70  ERJ-PA3D1400V  [ERJP03_PA3_(0603)]
R71  ERJ-PA3D1400V  [ERJP03_PA3_(0603)]
R72  ERJ-PA3D1400V  [ERJP03_PA3_(0603)]
R89  CRCW040212K0FKTD  [RESC1005X40N]
R90  CRCW0402510RFKEDC  [RESC1005X35N]
R91  CRCW04021K05FKED  [RESC1005X40N]
R92  ERJ-2BWFR050X  [ERJ_2LW_2BW_2B_(0402)]
R93  ESR01MZPJ100  [RESC1005X40N]
R94  RC0402JR-1015KL  [RESC1005X40N]
R95  CR0402-FX-1022GLF  [RESC1005X40N]
R96  RC0402JR-133K3L  [RESC1005X40N]
R97  ERJ-2RKF2002X  [ERJ2R_(0402)]
R99  ERJ-2RKF2002X  [ERJ2R_(0402)]
R100  ERJ-2RKF2002X  [ERJ2R_(0402)]
R101  CRCW040212K0FKTD  [RESC1005X40N]
R117  ERJ-PA3D1400V  [ERJP03_PA3_(0603)]
R118  ERJ-PA3D1400V  [ERJP03_PA3_(0603)]
R119  ERJ-PA3D1400V  [ERJP03_PA3_(0603)]
R120  ERJ-PA3D1400V  [ERJP03_PA3_(0603)]
R121  ERJ-PA3D1400V  [ERJP03_PA3_(0603)]
R122  ERJ-PA3D1400V  [ERJP03_PA3_(0603)]
R123  ERJ-PA3D1400V  [ERJP03_PA3_(0603)]
R124  ERJ-PA3D1400V  [ERJP03_PA3_(0603)]
R127  CRCW0402510RFKEDC  [RESC1005X35N]
R128  CRCW04021K05FKED  [RESC1005X40N]
R129  ERJ-2BWFR050X  [ERJ_2LW_2BW_2B_(0402)]
R130  ESR01MZPJ100  [RESC1005X40N]
R131  RC0402JR-1015KL  [RESC1005X40N]
R132  CR0402-FX-1022GLF  [RESC1005X40N]
R133  RC0402JR-133K3L  [RESC1005X40N]
R134  ERJ-2RKF2002X  [ERJ2R_(0402)]
R135  ERJ-2RKF2002X  [ERJ2R_(0402)]
R136  CRCW040212K0FKTD  [RESC1005X40N]
R137  CRCW0402510RFKEDC  [RESC1005X35N]
R138  CRCW04021K05FKED  [RESC1005X40N]
R139  ERJ-2BWFR050X  [ERJ_2LW_2BW_2B_(0402)]
R140  ESR01MZPJ100  [RESC1005X40N]
R141  RC0402JR-1015KL  [RESC1005X40N]
R142  CR0402-FX-1022GLF  [RESC1005X40N]
R143  RC0402JR-133K3L  [RESC1005X40N]
R144  ERJ-2RKF2002X  [ERJ2R_(0402)]
R145  ERJ-2RKF2002X  [ERJ2R_(0402)]
R146  ERJ-2RKF2002X  [ERJ2R_(0402)]
R147  CRCW04021K30FKTD  [RESC1005X40N]
R148  CRCW04021K30FKTD  [RESC1005X40N]
R149  CRCW04021K30FKTD  [RESC1005X40N]
R150  CRCW04021K30FKTD  [RESC1005X40N]
R164  CRCW040212K0FKTD  [RESC1005X40N]
R165  CRCW0402510RFKEDC  [RESC1005X35N]
R166  CRCW04021K05FKED  [RESC1005X40N]
R167  ERJ-2BWFR050X  [ERJ_2LW_2BW_2B_(0402)]
R168  ESR01MZPJ100  [RESC1005X40N]
R169  RC0402JR-1015KL  [RESC1005X40N]
R170  CR0402-FX-1022GLF  [RESC1005X40N]
R171  RC0402JR-133K3L  [RESC1005X40N]
R172  ERJ-2RKF2002X  [ERJ2R_(0402)]
R173  ERJ-2RKF2002X  [ERJ2R_(0402)]
R174  CRCW040212K0FKTD  [RESC1005X40N]
R175  CRCW0402510RFKEDC  [RESC1005X35N]
R176  CRCW04021K05FKED  [RESC1005X40N]
R177  ERJ-2BWFR050X  [ERJ_2LW_2BW_2B_(0402)]
R178  ESR01MZPJ100  [RESC1005X40N]
R179  RC0402JR-1015KL  [RESC1005X40N]
R180  CR0402-FX-1022GLF  [RESC1005X40N]
R181  RC0402JR-133K3L  [RESC1005X40N]
R182  ERJ-2RKF2002X  [ERJ2R_(0402)]
R183  ERJ-2RKF2002X  [ERJ2R_(0402)]
R184  ERJ-2RKF2002X  [ERJ2R_(0402)]
R185  CRCW040212K0FKTD  [RESC1005X40N]
R186  CRCW0402510RFKEDC  [RESC1005X35N]
R187  CRCW04021K05FKED  [RESC1005X40N]
R188  ERJ-2BWFR050X  [ERJ_2LW_2BW_2B_(0402)]
R189  ESR01MZPJ100  [RESC1005X40N]
R190  RC0402JR-1015KL  [RESC1005X40N]
R191  CR0402-FX-1022GLF  [RESC1005X40N]
R192  RC0402JR-133K3L  [RESC1005X40N]
R193  ERJ-2RKF2002X  [ERJ2R_(0402)]
R194  ERJ-2RKF2002X  [ERJ2R_(0402)]
R195  CRCW040212K0FKTD  [RESC1005X40N]
R196  CRCW0402510RFKEDC  [RESC1005X35N]
R197  CRCW04021K05FKED  [RESC1005X40N]
R198  ERJ-2BWFR050X  [ERJ_2LW_2BW_2B_(0402)]
R199  ESR01MZPJ100  [RESC1005X40N]
R200  RC0402JR-1015KL  [RESC1005X40N]
R202  CR0402-FX-1022GLF  [RESC1005X40N]
R204  RC0402JR-133K3L  [RESC1005X40N]
R206  ERJ-2RKF2002X  [ERJ2R_(0402)]
R208  ERJ-2RKF2002X  [ERJ2R_(0402)]
R210  ERJ-2RKF2002X  [ERJ2R_(0402)]
R212  CRCW040212K0FKTD  [RESC1005X40N]
R213  CRCW0402510RFKEDC  [RESC1005X35N]
R214  CRCW04021K05FKED  [RESC1005X40N]
R215  ERJ-2BWFR050X  [ERJ_2LW_2BW_2B_(0402)]
R216  ESR01MZPJ100  [RESC1005X40N]
R217  RC0402JR-1015KL  [RESC1005X40N]
R218  CR0402-FX-1022GLF  [RESC1005X40N]
R219  RC0402JR-133K3L  [RESC1005X40N]
R220  ERJ-2RKF2002X  [ERJ2R_(0402)]
R222  ERJ-2RKF2002X  [ERJ2R_(0402)]
R223  CRCW040212K0FKTD  [RESC1005X40N]
R224  CRCW0402510RFKEDC  [RESC1005X35N]
R225  CRCW04021K05FKED  [RESC1005X40N]
R226  ERJ-2BWFR050X  [ERJ_2LW_2BW_2B_(0402)]
R228  ESR01MZPJ100  [RESC1005X40N]
R240  RC0402JR-1015KL  [RESC1005X40N]
R241  CR0402-FX-1022GLF  [RESC1005X40N]
R242  RC0402JR-133K3L  [RESC1005X40N]
R243  ERJ-2RKF2002X  [ERJ2R_(0402)]
R244  ERJ-2RKF2002X  [ERJ2R_(0402)]
R245  ERJ-2RKF2002X  [ERJ2R_(0402)]
R246  CRCW040212K0FKTD  [RESC1005X40N]
R247  CRCW0402510RFKEDC  [RESC1005X35N]
R248  CRCW04021K05FKED  [RESC1005X40N]
R249  ERJ-2BWFR050X  [ERJ_2LW_2BW_2B_(0402)]
R250  ESR01MZPJ100  [RESC1005X40N]
R251  RC0402JR-1015KL  [RESC1005X40N]
R252  CR0402-FX-1022GLF  [RESC1005X40N]
R253  RC0402JR-133K3L  [RESC1005X40N]
R254  ERJ-2RKF2002X  [ERJ2R_(0402)]
R255  ERJ-2RKF2002X  [ERJ2R_(0402)]
R256  CRCW040212K0FKTD  [RESC1005X40N]
R257  CRCW0402510RFKEDC  [RESC1005X35N]
R258  CRCW04021K05FKED  [RESC1005X40N]
R259  ERJ-2BWFR050X  [ERJ_2LW_2BW_2B_(0402)]
R260  ESR01MZPJ100  [RESC1005X40N]
R261  RC0402JR-1015KL  [RESC1005X40N]
R262  CR0402-FX-1022GLF  [RESC1005X40N]
R263  RC0402JR-133K3L  [RESC1005X40N]
R264  ERJ-2RKF2002X  [ERJ2R_(0402)]
R265  ERJ-2RKF2002X  [ERJ2R_(0402)]
R266  ERJ-2RKF2002X  [ERJ2R_(0402)]
R267  CRCW040212K0FKTD  [RESC1005X40N]
R268  CRCW0402510RFKEDC  [RESC1005X35N]
R269  CRCW04021K05FKED  [RESC1005X40N]
R270  ERJ-2BWFR050X  [ERJ_2LW_2BW_2B_(0402)]
R271  ESR01MZPJ100  [RESC1005X40N]
R272  RC0402JR-1015KL  [RESC1005X40N]
R273  CR0402-FX-1022GLF  [RESC1005X40N]
R274  RC0402JR-133K3L  [RESC1005X40N]
R275  ERJ-2RKF2002X  [ERJ2R_(0402)]
R276  ERJ-2RKF2002X  [ERJ2R_(0402)]
R277  CRCW040212K0FKTD  [RESC1005X40N]
R278  CRCW0402510RFKEDC  [RESC1005X35N]
R279  CRCW04021K05FKED  [RESC1005X40N]
R280  ERJ-2BWFR050X  [ERJ_2LW_2BW_2B_(0402)]
R281  ESR01MZPJ100  [RESC1005X40N]
R282  RC0402JR-1015KL  [RESC1005X40N]
R283  CR0402-FX-1022GLF  [RESC1005X40N]
R284  RC0402JR-133K3L  [RESC1005X40N]
R285  ERJ-2RKF2002X  [ERJ2R_(0402)]
R286  ERJ-2RKF2002X  [ERJ2R_(0402)]
R287  ERJ-2RKF2002X  [ERJ2R_(0402)]
R288  CRCW040212K0FKTD  [RESC1005X40N]
R289  CRCW0402510RFKEDC  [RESC1005X35N]
R290  CRCW04021K05FKED  [RESC1005X40N]
R291  ERJ-2BWFR050X  [ERJ_2LW_2BW_2B_(0402)]
R292  ESR01MZPJ100  [RESC1005X40N]
R293  RC0402JR-1015KL  [RESC1005X40N]
R294  CR0402-FX-1022GLF  [RESC1005X40N]
R295  RC0402JR-133K3L  [RESC1005X40N]
R296  ERJ-2RKF2002X  [ERJ2R_(0402)]
R297  ERJ-2RKF2002X  [ERJ2R_(0402)]
R298  CRCW040212K0FKTD  [RESC1005X40N]
R299  CRCW0402510RFKEDC  [RESC1005X35N]
R300  CRCW04021K05FKED  [RESC1005X40N]
R301  ERJ-2BWFR050X  [ERJ_2LW_2BW_2B_(0402)]
R302  ESR01MZPJ100  [RESC1005X40N]
R303  RC0402JR-1015KL  [RESC1005X40N]
R304  CR0402-FX-1022GLF  [RESC1005X40N]
R305  RC0402JR-133K3L  [RESC1005X40N]
R306  ERJ-2RKF2002X  [ERJ2R_(0402)]
R307  ERJ-2RKF2002X  [ERJ2R_(0402)]
R308  ERJ-2RKF2002X  [ERJ2R_(0402)]
R309  CRCW040212K0FKTD  [RESC1005X40N]
R310  CRCW0402510RFKEDC  [RESC1005X35N]
R311  CRCW04021K05FKED  [RESC1005X40N]
R312  ERJ-2BWFR050X  [ERJ_2LW_2BW_2B_(0402)]
R313  ESR01MZPJ100  [RESC1005X40N]
R314  RC0402JR-1015KL  [RESC1005X40N]
R315  CR0402-FX-1022GLF  [RESC1005X40N]
R316  RC0402JR-133K3L  [RESC1005X40N]
R317  ERJ-2RKF2002X  [ERJ2R_(0402)]
R318  ERJ-2RKF2002X  [ERJ2R_(0402)]
R319  CRCW040212K0FKTD  [RESC1005X40N]
R320  CRCW0402510RFKEDC  [RESC1005X35N]
R321  CRCW04021K05FKED  [RESC1005X40N]
R322  ERJ-2BWFR050X  [ERJ_2LW_2BW_2B_(0402)]
R323  ESR01MZPJ100  [RESC1005X40N]
R324  RC0402JR-1015KL  [RESC1005X40N]
R325  CR0402-FX-1022GLF  [RESC1005X40N]
R326  RC0402JR-133K3L  [RESC1005X40N]
R327  ERJ-2RKF2002X  [ERJ2R_(0402)]
R328  ERJ-2RKF2002X  [ERJ2R_(0402)]
R329  ERJ-2RKF2002X  [ERJ2R_(0402)]
R330  CRCW040212K0FKTD  [RESC1005X40N]
R331  CRCW0402510RFKEDC  [RESC1005X35N]
R332  CRCW04021K05FKED  [RESC1005X40N]
R333  ERJ-2BWFR050X  [ERJ_2LW_2BW_2B_(0402)]
R334  ESR01MZPJ100  [RESC1005X40N]
R335  RC0402JR-1015KL  [RESC1005X40N]
R336  CR0402-FX-1022GLF  [RESC1005X40N]
R337  RC0402JR-133K3L  [RESC1005X40N]
R338  ERJ-2RKF2002X  [ERJ2R_(0402)]
R339  ERJ-2RKF2002X  [ERJ2R_(0402)]
R340  CRCW040212K0FKTD  [RESC1005X40N]
R341  CRCW0402510RFKEDC  [RESC1005X35N]
R342  CRCW04021K05FKED  [RESC1005X40N]
R343  ERJ-2BWFR050X  [ERJ_2LW_2BW_2B_(0402)]
R344  ESR01MZPJ100  [RESC1005X40N]
R345  RC0402JR-1015KL  [RESC1005X40N]
R346  CR0402-FX-1022GLF  [RESC1005X40N]
R347  RC0402JR-133K3L  [RESC1005X40N]
R348  ERJ-2RKF2002X  [ERJ2R_(0402)]
R349  ERJ-2RKF2002X  [ERJ2R_(0402)]
R350  ERJ-2RKF2002X  [ERJ2R_(0402)]
R351  CRCW040212K0FKTD  [RESC1005X40N]
R352  CRCW0402510RFKEDC  [RESC1005X35N]
R353  CRCW04021K05FKED  [RESC1005X40N]
R354  ERJ-2BWFR050X  [ERJ_2LW_2BW_2B_(0402)]
R355  ESR01MZPJ100  [RESC1005X40N]
R356  RC0402JR-1015KL  [RESC1005X40N]
R357  CR0402-FX-1022GLF  [RESC1005X40N]
R358  RC0402JR-133K3L  [RESC1005X40N]
R359  ERJ-2RKF2002X  [ERJ2R_(0402)]
R360  ERJ-2RKF2002X  [ERJ2R_(0402)]
R361  CRCW040212K0FKTD  [RESC1005X40N]
R362  CRCW0402510RFKEDC  [RESC1005X35N]
R363  CRCW04021K05FKED  [RESC1005X40N]
R364  ERJ-2BWFR050X  [ERJ_2LW_2BW_2B_(0402)]
R365  ESR01MZPJ100  [RESC1005X40N]
R366  RC0402JR-1015KL  [RESC1005X40N]
R367  CR0402-FX-1022GLF  [RESC1005X40N]
R368  RC0402JR-133K3L  [RESC1005X40N]
R369  ERJ-2RKF2002X  [ERJ2R_(0402)]
R370  ERJ-2RKF2002X  [ERJ2R_(0402)]
R371  ERJ-2RKF2002X  [ERJ2R_(0402)]
R372  CRCW040212K0FKTD  [RESC1005X40N]
R373  CRCW0402510RFKEDC  [RESC1005X35N]
R374  CRCW04021K05FKED  [RESC1005X40N]
R375  ERJ-2BWFR050X  [ERJ_2LW_2BW_2B_(0402)]
R376  ESR01MZPJ100  [RESC1005X40N]
R377  RC0402JR-1015KL  [RESC1005X40N]
R378  CR0402-FX-1022GLF  [RESC1005X40N]
R379  RC0402JR-133K3L  [RESC1005X40N]
R380  ERJ-2RKF2002X  [ERJ2R_(0402)]
R381  ERJ-2RKF2002X  [ERJ2R_(0402)]
R382  CRCW040212K0FKTD  [RESC1005X40N]
R383  CRCW0402510RFKEDC  [RESC1005X35N]
R384  CRCW04021K05FKED  [RESC1005X40N]
R385  ERJ-2BWFR050X  [ERJ_2LW_2BW_2B_(0402)]
R386  ESR01MZPJ100  [RESC1005X40N]
R387  RC0402JR-1015KL  [RESC1005X40N]
R388  CR0402-FX-1022GLF  [RESC1005X40N]
R389  RC0402JR-133K3L  [RESC1005X40N]
R390  ERJ-2RKF2002X  [ERJ2R_(0402)]
R391  ERJ-2RKF2002X  [ERJ2R_(0402)]
R392  ERJ-2RKF2002X  [ERJ2R_(0402)]
R393  CRCW040212K0FKTD  [RESC1005X40N]
R394  CRCW0402510RFKEDC  [RESC1005X35N]
R395  CRCW04021K05FKED  [RESC1005X40N]
R396  ERJ-2BWFR050X  [ERJ_2LW_2BW_2B_(0402)]
R397  ESR01MZPJ100  [RESC1005X40N]
R398  RC0402JR-1015KL  [RESC1005X40N]
R399  CR0402-FX-1022GLF  [RESC1005X40N]
R400  RC0402JR-133K3L  [RESC1005X40N]
R401  ERJ-2RKF2002X  [ERJ2R_(0402)]
R402  ERJ-2RKF2002X  [ERJ2R_(0402)]
R403  CRCW040212K0FKTD  [RESC1005X40N]
R404  CRCW0402510RFKEDC  [RESC1005X35N]
R405  CRCW04021K05FKED  [RESC1005X40N]
R406  ERJ-2BWFR050X  [ERJ_2LW_2BW_2B_(0402)]
R407  ESR01MZPJ100  [RESC1005X40N]
R408  RC0402JR-1015KL  [RESC1005X40N]
R409  CR0402-FX-1022GLF  [RESC1005X40N]
R410  RC0402JR-133K3L  [RESC1005X40N]
R411  ERJ-2RKF2002X  [ERJ2R_(0402)]
R412  ERJ-2RKF2002X  [ERJ2R_(0402)]
R413  ERJ-2RKF2002X  [ERJ2R_(0402)]
R414  CRCW040212K0FKTD  [RESC1005X40N]
R415  CRCW0402510RFKEDC  [RESC1005X35N]
R416  CRCW04021K05FKED  [RESC1005X40N]
R417  ERJ-2BWFR050X  [ERJ_2LW_2BW_2B_(0402)]
R418  ESR01MZPJ100  [RESC1005X40N]
R419  RC0402JR-1015KL  [RESC1005X40N]
R420  CR0402-FX-1022GLF  [RESC1005X40N]
R421  RC0402JR-133K3L  [RESC1005X40N]
R422  ERJ-2RKF2002X  [ERJ2R_(0402)]
R423  ERJ-2RKF2002X  [ERJ2R_(0402)]
R424  CRCW040212K0FKTD  [RESC1005X40N]
R425  CRCW0402510RFKEDC  [RESC1005X35N]
R426  CRCW04021K05FKED  [RESC1005X40N]
R427  ERJ-2BWFR050X  [ERJ_2LW_2BW_2B_(0402)]
R428  ESR01MZPJ100  [RESC1005X40N]
R429  RC0402JR-1015KL  [RESC1005X40N]
R430  CR0402-FX-1022GLF  [RESC1005X40N]
R431  RC0402JR-133K3L  [RESC1005X40N]
R432  ERJ-2RKF2002X  [ERJ2R_(0402)]
R433  ERJ-2RKF2002X  [ERJ2R_(0402)]
R434  ERJ-2RKF2002X  [ERJ2R_(0402)]
R435  CRCW040212K0FKTD  [RESC1005X40N]
R436  CRCW0402510RFKEDC  [RESC1005X35N]
R437  CRCW04021K05FKED  [RESC1005X40N]
R438  ERJ-2BWFR050X  [ERJ_2LW_2BW_2B_(0402)]
R439  ESR01MZPJ100  [RESC1005X40N]
R440  RC0402JR-1015KL  [RESC1005X40N]
R441  CR0402-FX-1022GLF  [RESC1005X40N]
R442  RC0402JR-133K3L  [RESC1005X40N]
R443  ERJ-2RKF2002X  [ERJ2R_(0402)]
R444  ERJ-2RKF2002X  [ERJ2R_(0402)]
R445  ERJ-2RKF2002X  [ERJ2R_(0402)]
R446  ERJ-2RKF2002X  [ERJ2R_(0402)]
R447  ERJ-2RKF2002X  [ERJ2R_(0402)]
R448  ERJ-2RKF2002X  [ERJ2R_(0402)]
R449  ERJ-2RKF2002X  [ERJ2R_(0402)]
R450  ERJ-2RKF2002X  [ERJ2R_(0402)]
R451  ERJ-2RKF2002X  [ERJ2R_(0402)]
R452  ERJ-2RKF2002X  [ERJ2R_(0402)]
R453  ERJ-2RKF2002X  [ERJ2R_(0402)]
R454  ERJ-2RKF2002X  [ERJ2R_(0402)]
R455  ERJ-2RKF2002X  [ERJ2R_(0402)]
R456  ERJ-2RKF2002X  [ERJ2R_(0402)]
R457  ERJ-2RKF2002X  [ERJ2R_(0402)]
R458  ERJ-2RKF2002X  [ERJ2R_(0402)]
R517  CRG0402ZR  [RESC1005X40N]
R518  CRG0402ZR  [RESC1005X40N]
R519  CRG0402ZR  [RESC1005X40N]
R520  CRG0402ZR  [RESC1005X40N]
R521  CRG0402ZR  [RESC1005X40N]

### Nets
3.3V_DIGITAL: IC11.6(ADR1) IC13.5(ADR0) IC13.6(ADR1) IC15.6(ADR1) IC17.5(ADR0) IC19.5(ADR0) IC21.5(ADR0) IC23.5(ADR0) IC23.6(ADR1) R147.2 R148.2 R149.2 R150.2 ; also sheet 1,2,4,9,10
13.5V_BUS: IC4.11(VDD2) IC4.30(VDD1) IC11.11(VDD2) IC11.30(VDD1) IC12.11(VDD2) IC12.30(VDD1) IC13.11(VDD2) IC13.30(VDD1) IC14.11(VDD2) IC14.30(VDD1) IC15.11(VDD2) IC15.30(VDD1) IC16.11(VDD2) IC16.30(VDD1) IC17.11(VDD2) IC17.30(VDD1) IC18.11(VDD2) IC18.30(VDD1) IC19.11(VDD2) IC19.30(VDD1) IC20.11(VDD2) IC20.30(VDD1) IC21.11(VDD2) IC21.30(VDD1) IC22.11(VDD2) IC22.30(VDD1) IC23.11(VDD2) IC23.30(VDD1) R89.2 R92.1 R97.2 R99.2 R101.2 R129.1 R134.2 R136.2 R139.1 R144.2 R145.2 R164.2 R167.1 R172.2 R174.2 R177.1 R182.2 R183.2 R185.2 R188.1 R193.2 R195.2 R198.1 R206.2 R208.2 R212.2 R215.1 R220.2 R223.2 R226.1 R243.2 R244.2 R246.2 R249.1 R254.2 R256.2 R259.1 R264.2 R265.2 R267.2 R270.1 R275.2 R277.2 R280.1 R285.2 R286.2 R288.2 R291.1 R296.2 R298.2 R301.1 R306.2 R307.2 R309.2 R312.1 R317.2 R319.2 R322.1 R327.2 R328.2 R330.2 R333.1 R338.2 R340.2 R343.1 R348.2 R349.2 R351.2 R354.1 R359.2 R361.2 R364.1 R369.2 R370.2 R372.2 R375.1 R380.2 R382.2 R385.1 R390.2 R391.2 R393.2 R396.1 R401.2 R403.2 R406.1 R411.2 R412.2 R414.2 R417.1 R422.2 R424.2 R427.1 R432.2 R433.2 R435.2 R438.1 R443.2 R445.1 R446.1 R447.1 R448.1 R449.1 R450.1 R451.1 R452.1 R453.1 R454.1 R455.1 R456.1 R457.1 R458.1 ; also sheet 2,4,5,6,12
40G_GPIO: J5.54 ; also sheet 12
!THERMOCOUPLE_CS: R519.2 ; also sheet 12
ACCELEROMETER_X: D42.1(K) J6.26 ; also sheet 2
ACCELEROMETER_Y: D41.1(K) J6.28 ; also sheet 2
ACCELEROMETER_Z: D40.1(K) J6.30 ; also sheet 2
ADIN1_: IC4.23(ADIN1) LED97.1(A) R57.1
ADIN1_0: IC11.23(ADIN1) LED99.1(A) R65.1
ADIN1_0IN: D9.1(K) J5.11 R65.2
ADIN1_1: IC20.23(ADIN1) LED101.1(A) R67.1
ADIN1_1IN: D63.1(K) J5.21 R67.2
ADIN1_2: IC21.23(ADIN1) LED103.1(A) R69.1
ADIN1_2IN: D69.1(K) J5.31 R69.2
ADIN1_3: IC12.23(ADIN1) LED105.1(A) R71.1
ADIN1_3IN: D15.1(K) J6.41 R71.2
ADIN1_4: IC13.23(ADIN1) LED107.1(A) R117.1
ADIN1_4IN: D21.1(K) J6.51 R117.2
ADIN1_5: IC18.23(ADIN1) LED109.1(A) R119.1
ADIN1_5IN: D51.1(K) J6.61 R119.2
ADIN1_6: IC19.23(ADIN1) LED111.1(A) R121.1
ADIN1_6IN: D57.1(K) J6.71 R121.2
ADIN1_7: IC14.23(ADIN1) LED113.1(A) R123.1
ADIN1_7IN: D27.1(K) J6.01 R123.2
ADIN1_8_POWER_TEMP1: D33.1(K) IC15.23(ADIN1) J6.11 ; also sheet 4
ADIN1_9_5V_RAIL_VO: IC16.23(ADIN1) ; also sheet 5
ADIN1_10_14V_RAIL_VO: IC17.23(ADIN1) ; also sheet 5
ADIN1_11_TEMP2_OUT: IC22.23(ADIN1) ; also sheet 6
ADIN1_12_TEMP4_OUT: IC23.23(ADIN1) ; also sheet 6
ADIN1_IN: D3.1(K) J5.01 R57.2
ADIN2_: IC4.18(ADIN2) LED98.1(A) R58.1
ADIN2_0: IC11.18(ADIN2) LED100.1(A) R66.1
ADIN2_0IN: D12.1(K) J5.16 R66.2
ADIN2_1: IC20.18(ADIN2) LED102.1(A) R68.1
ADIN2_1IN: D66.1(K) J5.26 R68.2
ADIN2_2: IC21.18(ADIN2) LED104.1(A) R70.1
ADIN2_2IN: D72.1(K) J5.36 R70.2
ADIN2_3: IC12.18(ADIN2) LED106.1(A) R72.1
ADIN2_3IN: D18.1(K) J6.46 R72.2
ADIN2_4: IC13.18(ADIN2) LED108.1(A) R118.1
ADIN2_4IN: D24.1(K) J6.56 R118.2
ADIN2_5: IC18.18(ADIN2) LED110.1(A) R120.1
ADIN2_5IN: D54.1(K) J6.66 R120.2
ADIN2_6: IC19.18(ADIN2) LED112.1(A) R122.1
ADIN2_6IN: D60.1(K) J6.76 R122.2
ADIN2_7: IC14.18(ADIN2) LED114.1(A) R124.1
ADIN2_7IN: D30.1(K) J6.06 R124.2
ADIN2_8_POWER_TEMP2: D36.1(K) IC15.18(ADIN2) J6.16 ; also sheet 4
ADIN2_9_POWER_TEMP3: D39.1(K) IC16.18(ADIN2) J6.21 ; also sheet 4
ADIN2_10_6.5V_RAIL_VO: IC17.18(ADIN2) ; also sheet 5
ADIN2_11_TEMP1_OUT: IC22.18(ADIN2) ; also sheet 6
ADIN2_12_TEMP3_OUT: IC23.18(ADIN2) ; also sheet 6
ADIN2_IN: D6.1(K) J5.06 R58.2
C1: J5.58 R517.1 R520.1
C2: J5.56 R518.1 R521.1
C3: J5.60 R519.1
DIFF1_N: D1.1(K) J5.04 ; also sheet 1
DIFF1_P: D2.1(K) J5.02 ; also sheet 1
DIFF2_N: D4.1(K) J5.10 ; also sheet 1
DIFF2_P: D5.1(K) J5.08 ; also sheet 1
DIFF3_N: D7.1(K) J5.14 ; also sheet 1
DIFF3_P: D8.1(K) J5.12 ; also sheet 1
DIFF4_N: D10.1(K) J5.20 ; also sheet 1
DIFF4_P: D11.1(K) J5.18 ; also sheet 1
DIFF5_N: D61.1(K) J5.24 ; also sheet 1
DIFF5_P: D62.1(K) J5.22 ; also sheet 1
DIFF6_N: D64.1(K) J5.30 ; also sheet 1
DIFF6_P: D65.1(K) J5.28 ; also sheet 1
DIFF7_N: D67.1(K) J5.34 ; also sheet 1
DIFF7_P: D68.1(K) J5.32 ; also sheet 1
DIFF8_N: D70.1(K) J5.40 ; also sheet 1
DIFF8_P: D71.1(K) J5.38 ; also sheet 1
DIFF9_N: D13.1(K) J6.44 ; also sheet 1
DIFF9_P: D14.1(K) J6.42 ; also sheet 1
DIFF10_N: D16.1(K) J6.50 ; also sheet 1
DIFF10_P: D17.1(K) J6.48 ; also sheet 1
DIFF11_N: D19.1(K) J6.54 ; also sheet 1
DIFF11_P: D20.1(K) J6.52 ; also sheet 1
DIFF12_N: D22.1(K) J6.60 ; also sheet 1
DIFF12_P: D23.1(K) J6.58 ; also sheet 1
DIFF13_N: D49.1(K) J6.64 ; also sheet 1
DIFF13_P: D50.1(K) J6.62 ; also sheet 1
DIFF14_N: D52.1(K) J6.70 ; also sheet 1
DIFF14_P: D53.1(K) J6.68 ; also sheet 1
DIFF15_N: D55.1(K) J6.74 ; also sheet 1
DIFF15_P: D56.1(K) J6.72 ; also sheet 1
DIFF16_N: D58.1(K) J6.80 ; also sheet 1
DIFF16_P: D59.1(K) J6.78 ; also sheet 1
DIFF_GP1_N: D25.1(K) J6.04 ; also sheet 2
DIFF_GP1_P: D26.1(K) J6.02 ; also sheet 2
DIFF_GP2_N: D28.1(K) J6.10 ; also sheet 2
DIFF_GP2_P: D29.1(K) J6.08 ; also sheet 2
DIFF_GP3_N: D31.1(K) J6.14 ; also sheet 2
DIFF_GP3_P: D32.1(K) J6.12 ; also sheet 2
DIFF_GP4_N: D34.1(K) J6.20 ; also sheet 2
DIFF_GP4_P: D35.1(K) J6.18 ; also sheet 2
DIFF_GP5_N: D37.1(K) J6.24 ; also sheet 2
DIFF_GP5_P: D38.1(K) J6.22 ; also sheet 2
DIN1: D74.1(K) J5.66 ; also sheet 3
DIN2: D73.1(K) J5.68 ; also sheet 3
DIN3: D77.1(K) J5.70 ; also sheet 3
DIN4: D76.1(K) J5.72 ; also sheet 3
DIN5: D44.1(K) J5.74 ; also sheet 3
DIN6: D43.1(K) J5.76 ; also sheet 3
DIN7: D47.1(K) J5.78 ; also sheet 3
DIN8: D46.1(K) J5.80 ; also sheet 3
FB1_: IC4.26(FB1) R95.2 R96.2
FB1_0: IC11.26(FB1) R142.2 R143.2
FB1_1: IC20.26(FB1) R367.2 R368.2
FB1_2: IC21.26(FB1) R388.2 R389.2
FB1_3: IC12.26(FB1) R180.2 R181.2
FB1_4: IC13.26(FB1) R202.2 R204.2
FB1_5: IC18.26(FB1) R325.2 R326.2
FB1_6: IC19.26(FB1) R346.2 R347.2
FB1_7: IC14.26(FB1) R241.2 R242.2
FB1_8: IC15.26(FB1) R262.2 R263.2
FB1_9: IC16.26(FB1) R283.2 R284.2
FB1_10: IC17.26(FB1) R304.2 R305.2
FB1_11: IC22.26(FB1) R409.2 R410.2
FB1_12: IC23.26(FB1) R430.2 R431.2
FB2_: IC4.15(FB2) R132.2 R133.2
FB2_0: IC11.15(FB2) R170.2 R171.2
FB2_1: IC20.15(FB2) R378.2 R379.2
FB2_2: IC21.15(FB2) R399.2 R400.2
FB2_3: IC12.15(FB2) R191.2 R192.2
FB2_4: IC13.15(FB2) R218.2 R219.2
FB2_5: IC18.15(FB2) R336.2 R337.2
FB2_6: IC19.15(FB2) R357.2 R358.2
FB2_7: IC14.15(FB2) R252.2 R253.2
FB2_8: IC15.15(FB2) R273.2 R274.2
FB2_9: IC16.15(FB2) R294.2 R295.2
FB2_10: IC17.15(FB2) R315.2 R316.2
FB2_11: IC22.15(FB2) R420.2 R421.2
FB2_12: IC23.15(FB2) R441.2 R442.2
GATE1_: IC4.28(GATE1) R93.2 R94.2
GATE1_0: IC11.28(GATE1) R140.2 R141.2
GATE1_1: IC20.28(GATE1) R365.2 R366.2
GATE1_2: IC21.28(GATE1) R386.2 R387.2
GATE1_3: IC12.28(GATE1) R178.2 R179.2
GATE1_4: IC13.28(GATE1) R199.2 R200.2
GATE1_5: IC18.28(GATE1) R323.2 R324.2
GATE1_6: IC19.28(GATE1) R344.2 R345.2
GATE1_7: IC14.28(GATE1) R228.2 R240.2
GATE1_8: IC15.28(GATE1) R260.2 R261.2
GATE1_9: IC16.28(GATE1) R281.2 R282.2
GATE1_10: IC17.28(GATE1) R302.2 R303.2
GATE1_11: IC22.28(GATE1) R407.2 R408.2
GATE1_12: IC23.28(GATE1) R428.2 R429.2
GATE2_: IC4.13(GATE2) R130.2 R131.2
GATE2_0: IC11.13(GATE2) R168.2 R169.2
GATE2_1: IC20.13(GATE2) R376.2 R377.2
GATE2_2: IC21.13(GATE2) R397.2 R398.2
GATE2_3: IC12.13(GATE2) R189.2 R190.2
GATE2_4: IC13.13(GATE2) R216.2 R217.2
GATE2_5: IC18.13(GATE2) R334.2 R335.2
GATE2_6: IC19.13(GATE2) R355.2 R356.2
GATE2_7: IC14.13(GATE2) R250.2 R251.2
GATE2_8: IC15.13(GATE2) R271.2 R272.2
GATE2_9: IC16.13(GATE2) R292.2 R293.2
GATE2_10: IC17.13(GATE2) R313.2 R314.2
GATE2_11: IC22.13(GATE2) R418.2 R419.2
GATE2_12: IC23.13(GATE2) R439.2 R440.2
GND: C37.2 C39.2 C41.2 C42.2 C43.2 C44.2 C45.2 C46.2 C95.2 C97.2 C99.2 C101.2 C107.2 C112.2 C113.2 C114.2 C115.2 C116.2 C117.2 C118.2 C119.2 C120.2 C121.2 C122.2 C123.2 C124.2 C125.2 C126.2 C127.2 C128.2 C129.2 C130.2 C131.2 C132.2 C133.2 C134.2 C135.2 C136.2 C137.2 C138.2 C139.2 C140.2 C141.2 C142.2 C143.2 C144.2 C145.2 C146.2 C147.2 C148.2 C149.2 C150.2 C151.2 C152.2 C153.2 C154.2 C155.2 C156.2 C157.2 C158.2 C159.2 C160.2 C161.2 C162.2 C163.2 C164.2 C165.2 C166.2 C167.2 C168.2 D1.2(A) D2.2(A) D3.2(A) D4.2(A) D5.2(A) D6.2(A) D7.2(A) D8.2(A) D9.2(A) D10.2(A) D11.2(A) D12.2(A) D13.2(A) D14.2(A) D15.2(A) D16.2(A) D17.2(A) D18.2(A) D19.2(A) D20.2(A) D21.2(A) D22.2(A) D23.2(A) D24.2(A) D25.2(A) D26.2(A) D27.2(A) D28.2(A) D29.2(A) D30.2(A) D31.2(A) D32.2(A) D33.2(A) D34.2(A) D35.2(A) D36.2(A) D37.2(A) D38.2(A) D39.2(A) D40.2(A) D41.2(A) D42.2(A) D43.2(A) D44.2(A) D46.2(A) D47.2(A) D49.2(A) D50.2(A) D51.2(A) D52.2(A) D53.2(A) D54.2(A) D55.2(A) D56.2(A) D57.2(A) D58.2(A) D59.2(A) D60.2(A) D61.2(A) D62.2(A) D63.2(A) D64.2(A) D65.2(A) D66.2(A) D67.2(A) D68.2(A) D69.2(A) D70.2(A) D71.2(A) D72.2(A) D73.2(A) D74.2(A) D76.2(A) D77.2(A) IC4.4(GND) IC4.5(ADR0) IC4.7(ADR2) IC4.17(!EN2) IC4.24(!EN1) IC4.33(GND1) IC11.4(GND) IC11.7(ADR2) IC11.17(!EN2) IC11.24(!EN1) IC11.33(GND1) IC12.4(GND) IC12.5(ADR0) IC12.6(ADR1) IC12.7(ADR2) IC12.17(!EN2) IC12.24(!EN1) IC12.33(GND1) IC13.4(GND) IC13.7(ADR2) IC13.17(!EN2) IC13.24(!EN1) IC13.33(GND1) IC14.4(GND) IC14.5(ADR0) IC14.17(!EN2) IC14.24(!EN1) IC14.33(GND1) IC15.4(GND) IC15.17(!EN2) IC15.24(!EN1) IC15.33(GND1) IC16.4(GND) IC16.17(!EN2) IC16.24(!EN1) IC16.33(GND1) IC17.4(GND) IC17.17(!EN2) IC17.24(!EN1) IC17.33(GND1) IC18.4(GND) IC18.6(ADR1) IC18.7(ADR2) IC18.17(!EN2) IC18.24(!EN1) IC18.33(GND1) IC19.4(GND) IC19.6(ADR1) IC19.7(ADR2) IC19.17(!EN2) IC19.24(!EN1) IC19.33(GND1) IC20.4(GND) IC20.7(ADR2) IC20.17(!EN2) IC20.24(!EN1) IC20.33(GND1) IC21.4(GND) IC21.7(ADR2) IC21.17(!EN2) IC21.24(!EN1) IC21.33(GND1) IC22.4(GND) IC22.5(ADR0) IC22.6(ADR1) IC22.17(!EN2) IC22.24(!EN1) IC22.33(GND1) IC23.4(GND) IC23.17(!EN2) IC23.24(!EN1) IC23.33(GND1) J5.07 J5.09 J5.17 J5.19 J5.27 J5.29 J5.37 J5.39 J5.41 J5.43 J5.45 J5.47 J5.49 J5.51 J5.53 J5.55 J5.61 J5.63 J5.69 J5.71 J5.77 J5.79 J6.07 J6.09 J6.17 J6.19 J6.27 J6.29 J6.31 J6.32 J6.33 J6.34 J6.35 J6.36 J6.37 J6.38 J6.39 J6.40 J6.47 J6.49 J6.57 J6.59 J6.67 J6.69 J6.77 J6.79 LED3.2(K) LED5.2(K) LED8.2(K) LED10.2(K) LED13.2(K) LED15.2(K) LED18.2(K) LED20.2(K) LED23.2(K) LED25.2(K) LED28.2(K) LED30.2(K) LED33.2(K) LED35.2(K) LED38.2(K) LED40.2(K) LED43.2(K) LED45.2(K) LED48.2(K) LED50.2(K) LED53.2(K) LED55.2(K) LED58.2(K) LED60.2(K) LED63.2(K) LED65.2(K) LED68.2(K) LED70.2(K) LED71.1(K) LED72.1(K) LED73.1(K) LED74.1(K) LED75.1(K) LED76.1(K) LED77.1(K) LED78.1(K) LED79.1(K) LED80.1(K) LED81.1(K) LED82.1(K) LED83.1(K) LED84.1(K) LED97.2(K) LED98.2(K) LED99.2(K) LED100.2(K) LED101.2(K) LED102.2(K) LED103.2(K) LED104.2(K) LED105.2(K) LED106.2(K) LED107.2(K) LED108.2(K) LED109.2(K) LED110.2(K) LED111.2(K) LED112.2(K) LED113.2(K) LED114.2(K) R91.2 R96.1 R128.2 R133.1 R138.2 R143.1 R166.2 R171.1 R176.2 R181.1 R187.2 R192.1 R197.2 R204.1 R214.2 R219.1 R225.2 R242.1 R248.2 R253.1 R258.2 R263.1 R269.2 R274.1 R279.2 R284.1 R290.2 R295.1 R300.2 R305.1 R311.2 R316.1 R321.2 R326.1 R332.2 R337.1 R342.2 R347.1 R353.2 R358.1 R363.2 R368.1 R374.2 R379.1 R384.2 R389.1 R395.2 R400.1 R405.2 R410.1 R416.2 R421.1 R426.2 R431.1 R437.2 R442.1 ; also sheet 1,2,3,4,5,6,7,8,9,10,12
GPIO1_: IC4.25(GPIO1) LED1.1(K)
GPIO1_0: IC11.25(GPIO1) LED6.1(K)
GPIO1_1: IC20.25(GPIO1) LED51.1(K)
GPIO1_2: IC21.25(GPIO1) LED56.1(K)
GPIO1_3: IC12.25(GPIO1) LED11.1(K)
GPIO1_4: IC13.25(GPIO1) LED16.1(K)
GPIO1_5: IC18.25(GPIO1) LED41.1(K)
GPIO1_6: IC19.25(GPIO1) LED46.1(K)
GPIO1_7: IC14.25(GPIO1) LED21.1(K)
GPIO1_8: IC15.25(GPIO1) LED26.1(K)
GPIO1_9: IC16.25(GPIO1) LED31.1(K)
GPIO1_10: IC17.25(GPIO1) LED36.1(K)
GPIO1_11: IC22.25(GPIO1) LED61.1(K)
GPIO1_12: IC23.25(GPIO1) LED66.1(K)
GPIO2_: IC4.16(GPIO2) LED4.1(K)
GPIO2_0: IC11.16(GPIO2) LED9.1(K)
GPIO2_1: IC20.16(GPIO2) LED54.1(K)
GPIO2_2: IC21.16(GPIO2) LED59.1(K)
GPIO2_3: IC12.16(GPIO2) LED14.1(K)
GPIO2_4: IC13.16(GPIO2) LED19.1(K)
GPIO2_5: IC18.16(GPIO2) LED44.1(K)
GPIO2_6: IC19.16(GPIO2) LED49.1(K)
GPIO2_7: IC14.16(GPIO2) LED24.1(K)
GPIO2_8: IC15.16(GPIO2) LED29.1(K)
GPIO2_9: IC16.16(GPIO2) LED34.1(K)
GPIO2_10: IC17.16(GPIO2) LED39.1(K)
GPIO2_11: IC22.16(GPIO2) LED64.1(K)
GPIO2_12: IC23.16(GPIO2) LED69.1(K)
IM_OUT1: J5.62 ; also sheet 9
IM_OUT2: R518.2 ; also sheet 9
IP_OUT1: J5.64 ; also sheet 9
IP_OUT2: R517.2 ; also sheet 9
MASS_ON: IC4.22(ON) IC11.22(ON) IC12.22(ON) IC13.22(ON) IC14.22(ON) IC15.22(ON) IC16.22(ON) IC17.22(ON) IC18.22(ON) IC19.22(ON) IC20.22(ON) IC21.22(ON) IC22.22(ON) IC23.22(ON) ; also sheet 12
N$1: IC20.5(ADR0)
N$33: C37.1 IC4.1(SS)
N$34: C39.1 IC4.2(CONFIG) IC4.3(INTVCC)
N$35: C41.1 IC4.8(TIMER)
N$36: M1.3(G) R93.1
N$37: LED1.2(A) R97.1
N$38: LED2.2(A) R99.1
N$39: C42.1 R94.1
N$40: C44.1 IC11.1(SS)
N$41: IC4.21(!ALERT) LED2.1(K)
N$42: C45.1 IC11.2(CONFIG) IC11.3(INTVCC)
N$44: LED3.1(A) R100.1
N$45: IC4.6(ADR1)
N$47: M2.3(G) R130.1
N$48: C43.1 R131.1
N$49: LED4.2(A) R134.1
N$51: LED5.1(A) R135.1
N$55: C46.1 IC11.8(TIMER)
N$56: M3.3(G) R140.1
N$57: C95.1 R141.1
N$58: LED6.2(A) R144.1
N$59: IC11.21(!ALERT) LED7.1(K)
N$61: LED7.2(A) R145.1
N$62: LED8.1(A) R146.1
N$63: IC11.5(ADR0)
N$66: M4.3(G) R168.1
N$67: C97.1 R169.1
N$68: LED9.2(A) R172.1
N$69: LED10.1(A) R173.1
N$71: C99.1 IC12.1(SS)
N$72: C101.1 IC12.2(CONFIG) IC12.3(INTVCC)
N$73: C107.1 IC12.8(TIMER)
N$74: M5.3(G) R178.1
N$75: C112.1 R179.1
N$76: LED11.2(A) R182.1
N$77: IC12.21(!ALERT) LED12.1(K)
N$78: LED12.2(A) R183.1
N$79: LED13.1(A) R184.1
N$83: M6.3(G) R189.1
N$84: C113.1 R190.1
N$85: LED14.2(A) R193.1
N$111: LED15.1(A) R194.1
N$115: C114.1 IC13.1(SS)
N$117: C115.1 IC13.2(CONFIG) IC13.3(INTVCC)
N$121: C116.1 IC13.8(TIMER)
N$123: M7.3(G) R199.1
N$124: C117.1 R200.1
N$125: LED16.2(A) R206.1
N$126: IC13.21(!ALERT) LED17.1(K)
N$127: LED17.2(A) R208.1
N$129: LED18.1(A) R210.1
N$134: M8.3(G) R216.1
N$147: C118.1 R217.1
N$148: LED19.2(A) R220.1
N$149: LED20.1(A) R222.1
N$150: C119.1 IC14.1(SS)
N$151: C120.1 IC14.2(CONFIG) IC14.3(INTVCC)
N$152: C121.1 IC14.8(TIMER)
N$153: M9.3(G) R228.1
N$154: C122.1 R240.1
N$155: LED21.2(A) R243.1
N$156: IC14.21(!ALERT) LED22.1(K)
N$157: LED22.2(A) R244.1
N$158: LED23.1(A) R245.1
N$160: IC14.6(ADR1)
N$161: IC14.7(ADR2)
N$162: M10.3(G) R250.1
N$163: C123.1 R251.1
N$164: LED24.2(A) R254.1
N$165: LED25.1(A) R255.1
N$167: C124.1 IC15.1(SS)
N$168: C125.1 IC15.2(CONFIG) IC15.3(INTVCC)
N$169: C126.1 IC15.8(TIMER)
N$172: M11.3(G) R260.1
N$173: C127.1 R261.1
N$174: LED26.2(A) R264.1
N$175: IC15.21(!ALERT) LED27.1(K)
N$176: LED27.2(A) R265.1
N$177: LED28.1(A) R266.1
N$178: IC15.5(ADR0)
N$181: IC15.7(ADR2)
N$182: M12.3(G) R271.1
N$183: C128.1 R272.1
N$184: LED29.2(A) R275.1
N$185: LED30.1(A) R276.1
N$186: C129.1 IC16.1(SS)
N$187: C130.1 IC16.2(CONFIG) IC16.3(INTVCC)
N$188: C131.1 IC16.8(TIMER)
N$189: M13.3(G) R281.1
N$191: C132.1 R282.1
N$192: LED31.2(A) R285.1
N$193: IC16.21(!ALERT) LED32.1(K)
N$194: LED32.2(A) R286.1
N$195: LED33.1(A) R287.1
N$196: IC16.5(ADR0)
N$197: IC16.6(ADR1)
N$198: IC16.7(ADR2)
N$199: M14.3(G) R292.1
N$201: C133.1 R293.1
N$202: LED34.2(A) R296.1
N$203: LED35.1(A) R297.1
N$204: C134.1 IC17.1(SS)
N$205: C135.1 IC17.2(CONFIG) IC17.3(INTVCC)
N$206: C136.1 IC17.8(TIMER)
N$207: M15.3(G) R302.1
N$208: C137.1 R303.1
N$209: LED36.2(A) R306.1
N$211: IC17.21(!ALERT) LED37.1(K)
N$212: LED37.2(A) R307.1
N$213: LED38.1(A) R308.1
N$215: IC17.6(ADR1)
N$216: IC17.7(ADR2)
N$217: M16.3(G) R313.1
N$218: C138.1 R314.1
N$219: LED39.2(A) R317.1
N$221: LED40.1(A) R318.1
N$222: C139.1 IC18.1(SS)
N$223: C140.1 IC18.2(CONFIG) IC18.3(INTVCC)
N$224: C141.1 IC18.8(TIMER)
N$225: M17.3(G) R323.1
N$226: C142.1 R324.1
N$227: LED41.2(A) R327.1
N$228: IC18.21(!ALERT) LED42.1(K)
N$229: LED42.2(A) R328.1
N$231: LED43.1(A) R329.1
N$232: IC18.5(ADR0)
N$235: M18.3(G) R334.1
N$236: C143.1 R335.1
N$237: LED44.2(A) R338.1
N$238: LED45.1(A) R339.1
N$239: C144.1 IC19.1(SS)
N$241: C145.1 IC19.2(CONFIG) IC19.3(INTVCC)
N$242: C146.1 IC19.8(TIMER)
N$243: M19.3(G) R344.1
N$244: C147.1 R345.1
N$245: LED46.2(A) R348.1
N$246: IC19.21(!ALERT) LED47.1(K)
N$247: LED47.2(A) R349.1
N$248: LED48.1(A) R350.1
N$253: M20.3(G) R355.1
N$254: C148.1 R356.1
N$255: LED49.2(A) R359.1
N$256: LED50.1(A) R360.1
N$257: C149.1 IC20.1(SS)
N$258: C150.1 IC20.2(CONFIG) IC20.3(INTVCC)
N$259: C151.1 IC20.8(TIMER)
N$261: M21.3(G) R365.1
N$262: C152.1 R366.1
N$263: LED51.2(A) R369.1
N$264: IC20.21(!ALERT) LED52.1(K)
N$265: LED52.2(A) R370.1
N$266: LED53.1(A) R371.1
N$268: IC20.6(ADR1)
N$270: M22.3(G) R376.1
N$271: C153.1 R377.1
N$272: LED54.2(A) R380.1
N$273: LED55.1(A) R381.1
N$274: C154.1 IC21.1(SS)
N$275: C155.1 IC21.2(CONFIG) IC21.3(INTVCC)
N$276: C156.1 IC21.8(TIMER)
N$277: M23.3(G) R386.1
N$278: C157.1 R387.1
N$279: LED56.2(A) R390.1
N$280: IC21.21(!ALERT) LED57.1(K)
N$281: LED57.2(A) R391.1
N$282: LED58.1(A) R392.1
N$284: IC21.6(ADR1)
N$286: M24.3(G) R397.1
N$287: C158.1 R398.1
N$288: LED59.2(A) R401.1
N$289: LED60.1(A) R402.1
N$290: C159.1 IC22.1(SS)
N$291: C160.1 IC22.2(CONFIG) IC22.3(INTVCC)
N$292: C161.1 IC22.8(TIMER)
N$293: M25.3(G) R407.1
N$294: C162.1 R408.1
N$295: LED61.2(A) R411.1
N$296: IC22.21(!ALERT) LED62.1(K)
N$297: LED62.2(A) R412.1
N$298: LED63.1(A) R413.1
N$301: IC22.7(ADR2)
N$302: M26.3(G) R418.1
N$303: C163.1 R419.1
N$304: LED64.2(A) R422.1
N$305: LED65.1(A) R423.1
N$306: C164.1 IC23.1(SS)
N$307: C165.1 IC23.2(CONFIG) IC23.3(INTVCC)
N$308: C166.1 IC23.8(TIMER)
N$309: M27.3(G) R428.1
N$310: C167.1 R429.1
N$311: LED66.2(A) R432.1
N$312: IC23.21(!ALERT) LED67.1(K)
N$313: LED67.2(A) R433.1
N$314: LED68.1(A) R434.1
N$317: IC23.7(ADR2)
N$318: M28.3(G) R439.1
N$319: C168.1 R440.1
N$320: LED69.2(A) R443.1
N$321: LED70.1(A) R444.1
N$322: LED71.2(A) R445.2
N$323: LED72.2(A) R446.2
N$324: LED73.2(A) R447.2
N$325: LED74.2(A) R448.2
N$326: LED75.2(A) R449.2
N$327: LED76.2(A) R450.2
N$328: LED77.2(A) R451.2
N$329: LED78.2(A) R452.2
N$330: LED79.2(A) R453.2
N$331: LED80.2(A) R454.2
N$332: LED81.2(A) R455.2
N$333: LED82.2(A) R456.2
N$334: LED83.2(A) R457.2
N$335: LED84.2(A) R458.2
OV1_: IC4.32(OV1) R90.2 R91.1
OV1_0: IC11.32(OV1) R137.2 R138.1
OV1_1: IC20.32(OV1) R362.2 R363.1
OV1_2: IC21.32(OV1) R383.2 R384.1
OV1_3: IC12.32(OV1) R175.2 R176.1
OV1_4: IC13.32(OV1) R196.2 R197.1
OV1_5: IC18.32(OV1) R320.2 R321.1
OV1_6: IC19.32(OV1) R341.2 R342.1
OV1_7: IC14.32(OV1) R224.2 R225.1
OV1_8: IC15.32(OV1) R257.2 R258.1
OV1_9: IC16.32(OV1) R278.2 R279.1
OV1_10: IC17.32(OV1) R299.2 R300.1
OV1_11: IC22.32(OV1) R404.2 R405.1
OV1_12: IC23.32(OV1) R425.2 R426.1
OV2_: IC4.9(OV2) R127.2 R128.1
OV2_0: IC11.9(OV2) R165.2 R166.1
OV2_1: IC20.9(OV2) R373.2 R374.1
OV2_2: IC21.9(OV2) R394.2 R395.1
OV2_3: IC12.9(OV2) R186.2 R187.1
OV2_4: IC13.9(OV2) R213.2 R214.1
OV2_5: IC18.9(OV2) R331.2 R332.1
OV2_6: IC19.9(OV2) R352.2 R353.1
OV2_7: IC14.9(OV2) R247.2 R248.1
OV2_8: IC15.9(OV2) R268.2 R269.1
OV2_9: IC16.9(OV2) R289.2 R290.1
OV2_10: IC17.9(OV2) R310.2 R311.1
OV2_11: IC22.9(OV2) R415.2 R416.1
OV2_12: IC23.9(OV2) R436.2 R437.1
SCL1: IC4.20(SCL) IC11.20(SCL) IC12.20(SCL) IC13.20(SCL) IC18.20(SCL) IC20.20(SCL) IC21.20(SCL) R148.1 ; also sheet 12
SCL2: IC14.20(SCL) IC15.20(SCL) IC16.20(SCL) IC17.20(SCL) IC19.20(SCL) IC22.20(SCL) IC23.20(SCL) R150.1 ; also sheet 12
SDA1: IC4.19(SDA) IC11.19(SDA) IC12.19(SDA) IC13.19(SDA) IC18.19(SDA) IC20.19(SDA) IC21.19(SDA) R147.1 ; also sheet 12
SDA2: IC14.19(SDA) IC15.19(SDA) IC16.19(SDA) IC17.19(SDA) IC19.19(SDA) IC22.19(SDA) IC23.19(SDA) R149.1 ; also sheet 12
SENSE1_: IC4.29(SENSE1-) M1.1(D) M1.2(D) M1.5(D) M1.6(D) M1.7(D) R92.2
SENSE1_0: IC11.29(SENSE1-) M3.1(D) M3.2(D) M3.5(D) M3.6(D) M3.7(D) R139.2
SENSE1_1: IC20.29(SENSE1-) M21.1(D) M21.2(D) M21.5(D) M21.6(D) M21.7(D) R364.2
SENSE1_2: IC21.29(SENSE1-) M23.1(D) M23.2(D) M23.5(D) M23.6(D) M23.7(D) R385.2
SENSE1_3: IC12.29(SENSE1-) M5.1(D) M5.2(D) M5.5(D) M5.6(D) M5.7(D) R177.2
SENSE1_4: IC13.29(SENSE1-) M7.1(D) M7.2(D) M7.5(D) M7.6(D) M7.7(D) R198.2
SENSE1_5: IC18.29(SENSE1-) M17.1(D) M17.2(D) M17.5(D) M17.6(D) M17.7(D) R322.2
SENSE1_6: IC19.29(SENSE1-) M19.1(D) M19.2(D) M19.5(D) M19.6(D) M19.7(D) R343.2
SENSE1_7: IC14.29(SENSE1-) M9.1(D) M9.2(D) M9.5(D) M9.6(D) M9.7(D) R226.2
SENSE1_8: IC15.29(SENSE1-) M11.1(D) M11.2(D) M11.5(D) M11.6(D) M11.7(D) R259.2
SENSE1_9: IC16.29(SENSE1-) M13.1(D) M13.2(D) M13.5(D) M13.6(D) M13.7(D) R280.2
SENSE1_10: IC17.29(SENSE1-) M15.1(D) M15.2(D) M15.5(D) M15.6(D) M15.7(D) R301.2
SENSE1_11: IC22.29(SENSE1-) M25.1(D) M25.2(D) M25.5(D) M25.6(D) M25.7(D) R406.2
SENSE1_12: IC23.29(SENSE1-) M27.1(D) M27.2(D) M27.5(D) M27.6(D) M27.7(D) R427.2
SENSE2_: IC4.12(SENSE2-) M2.1(D) M2.2(D) M2.5(D) M2.6(D) M2.7(D) R129.2
SENSE2_0: IC11.12(SENSE2-) M4.1(D) M4.2(D) M4.5(D) M4.6(D) M4.7(D) R167.2
SENSE2_1: IC20.12(SENSE2-) M22.1(D) M22.2(D) M22.5(D) M22.6(D) M22.7(D) R375.2
SENSE2_2: IC21.12(SENSE2-) M24.1(D) M24.2(D) M24.5(D) M24.6(D) M24.7(D) R396.2
SENSE2_3: IC12.12(SENSE2-) M6.1(D) M6.2(D) M6.5(D) M6.6(D) M6.7(D) R188.2
SENSE2_4: IC13.12(SENSE2-) M8.1(D) M8.2(D) M8.5(D) M8.6(D) M8.7(D) R215.2
SENSE2_5: IC18.12(SENSE2-) M18.1(D) M18.2(D) M18.5(D) M18.6(D) M18.7(D) R333.2
SENSE2_6: IC19.12(SENSE2-) M20.1(D) M20.2(D) M20.5(D) M20.6(D) M20.7(D) R354.2
SENSE2_7: IC14.12(SENSE2-) M10.1(D) M10.2(D) M10.5(D) M10.6(D) M10.7(D) R249.2
SENSE2_8: IC15.12(SENSE2-) M12.1(D) M12.2(D) M12.5(D) M12.6(D) M12.7(D) R270.2
SENSE2_9: IC16.12(SENSE2-) M14.1(D) M14.2(D) M14.5(D) M14.6(D) M14.7(D) R291.2
SENSE2_10: IC17.12(SENSE2-) M16.1(D) M16.2(D) M16.5(D) M16.6(D) M16.7(D) R312.2
SENSE2_11: IC22.12(SENSE2-) M26.1(D) M26.2(D) M26.5(D) M26.6(D) M26.7(D) R417.2
SENSE2_12: IC23.12(SENSE2-) M28.1(D) M28.2(D) M28.5(D) M28.6(D) M28.7(D) R438.2
SOURCE1_: IC4.27(SOURCE1) J5.03 M1.4(S) M1.8(S) R95.1 R100.2
SOURCE1_0: IC11.27(SOURCE1) J5.13 M3.4(S) M3.8(S) R142.1 R146.2
SOURCE1_1: IC20.27(SOURCE1) J5.23 M21.4(S) M21.8(S) R367.1 R371.2
SOURCE1_2: IC21.27(SOURCE1) J5.33 M23.4(S) M23.8(S) R388.1 R392.2
SOURCE1_3: IC12.27(SOURCE1) J6.43 M5.4(S) M5.8(S) R180.1 R184.2
SOURCE1_4: IC13.27(SOURCE1) J6.53 M7.4(S) M7.8(S) R202.1 R210.2
SOURCE1_5: IC18.27(SOURCE1) J6.63 M17.4(S) M17.8(S) R325.1 R329.2
SOURCE1_6: IC19.27(SOURCE1) J6.73 M19.4(S) M19.8(S) R346.1 R350.2
SOURCE1_7: IC14.27(SOURCE1) J6.03 M9.4(S) M9.8(S) R241.1 R245.2
SOURCE1_8: IC15.27(SOURCE1) J6.13 M11.4(S) M11.8(S) R262.1 R266.2
SOURCE1_9: IC16.27(SOURCE1) J6.23 M13.4(S) M13.8(S) R283.1 R287.2
SOURCE1_10: IC17.27(SOURCE1) J5.57 M15.4(S) M15.8(S) R304.1 R308.2
SOURCE1_11: IC22.27(SOURCE1) J5.65 M25.4(S) M25.8(S) R409.1 R413.2
SOURCE1_12: IC23.27(SOURCE1) J5.73 M27.4(S) M27.8(S) R430.1 R434.2
SOURCE2_: IC4.14(SOURCE2) J5.05 M2.4(S) M2.8(S) R132.1 R135.2
SOURCE2_0: IC11.14(SOURCE2) J5.15 M4.4(S) M4.8(S) R170.1 R173.2
SOURCE2_1: IC20.14(SOURCE2) J5.25 M22.4(S) M22.8(S) R378.1 R381.2
SOURCE2_2: IC21.14(SOURCE2) J5.35 M24.4(S) M24.8(S) R399.1 R402.2
SOURCE2_3: IC12.14(SOURCE2) J6.45 M6.4(S) M6.8(S) R191.1 R194.2
SOURCE2_4: IC13.14(SOURCE2) J6.55 M8.4(S) M8.8(S) R218.1 R222.2
SOURCE2_5: IC18.14(SOURCE2) J6.65 M18.4(S) M18.8(S) R336.1 R339.2
SOURCE2_6: IC19.14(SOURCE2) J6.75 M20.4(S) M20.8(S) R357.1 R360.2
SOURCE2_7: IC14.14(SOURCE2) J6.05 M10.4(S) M10.8(S) R252.1 R255.2
SOURCE2_8: IC15.14(SOURCE2) J6.15 M12.4(S) M12.8(S) R273.1 R276.2
SOURCE2_9: IC16.14(SOURCE2) J6.25 M14.4(S) M14.8(S) R294.1 R297.2
SOURCE2_10: IC17.14(SOURCE2) J5.59 M16.4(S) M16.8(S) R315.1 R318.2
SOURCE2_11: IC22.14(SOURCE2) J5.67 M26.4(S) M26.8(S) R420.1 R423.2
SOURCE2_12: IC23.14(SOURCE2) J5.75 M28.4(S) M28.8(S) R441.1 R444.2
THERMOCOUPLE_MISO: R521.2 ; also sheet 12
THERMOCOUPLE_SCLK: R520.2 ; also sheet 12
UV1_: IC4.31(UV1) R89.1 R90.1
UV1_0: IC11.31(UV1) R136.1 R137.1
UV1_1: IC20.31(UV1) R361.1 R362.1
UV1_2: IC21.31(UV1) R382.1 R383.1
UV1_3: IC12.31(UV1) R174.1 R175.1
UV1_4: IC13.31(UV1) R195.1 R196.1
UV1_5: IC18.31(UV1) R319.1 R320.1
UV1_6: IC19.31(UV1) R340.1 R341.1
UV1_7: IC14.31(UV1) R223.1 R224.1
UV1_8: IC15.31(UV1) R256.1 R257.1
UV1_9: IC16.31(UV1) R277.1 R278.1
UV1_10: IC17.31(UV1) R298.1 R299.1
UV1_11: IC22.31(UV1) R403.1 R404.1
UV1_12: IC23.31(UV1) R424.1 R425.1
UV2_: IC4.10(UV2) R101.1 R127.1
UV2_0: IC11.10(UV2) R164.1 R165.1
UV2_1: IC20.10(UV2) R372.1 R373.1
UV2_2: IC21.10(UV2) R393.1 R394.1
UV2_3: IC12.10(UV2) R185.1 R186.1
UV2_4: IC13.10(UV2) R212.1 R213.1
UV2_5: IC18.10(UV2) R330.1 R331.1
UV2_6: IC19.10(UV2) R351.1 R352.1
UV2_7: IC14.10(UV2) R246.1 R247.1
UV2_8: IC15.10(UV2) R267.1 R268.1
UV2_9: IC16.10(UV2) R288.1 R289.1
UV2_10: IC17.10(UV2) R309.1 R310.1
UV2_11: IC22.10(UV2) R414.1 R415.1
UV2_12: IC23.10(UV2) R435.1 R436.1
Unconnected: J5.42 J5.44 J5.46 J5.48 J5.50 J5.52

### Notes on the sheet
- Single ended digital inputs
  Splice GND node between 2 sensors
  2 sensors share same short circuit protection
- Analog accelerometer | SPI LINK 40G accelerometer | SPI LINK thermocouple
- Output power supply temperature voltage
- General differential sensor inputs
- Strain Gauge differential connectors
- Strain Gauge differential connectors
- ESD diodes
- MOSFET with harmonic suppression 
  and inrush current resistor
- Current shunt
- UV OV feedback network
- Feedback network | Power bad indicator | Output indicator
- On pin - Hold low on start up
  Mass clear fault register
- Visual indicator that power is available 
  to the node at this segment of the board
- Device address from data sheet
- Fault or ADC conversion indicator
- ADIN input voltage clamp and indicator